# Altium project mantarray_beta2_sensor.PrjPcb (part 1 of 2)
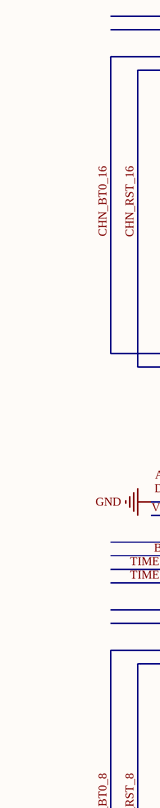
[diagram p0: mantarray_beta2_sensor.SchDoc, top left]
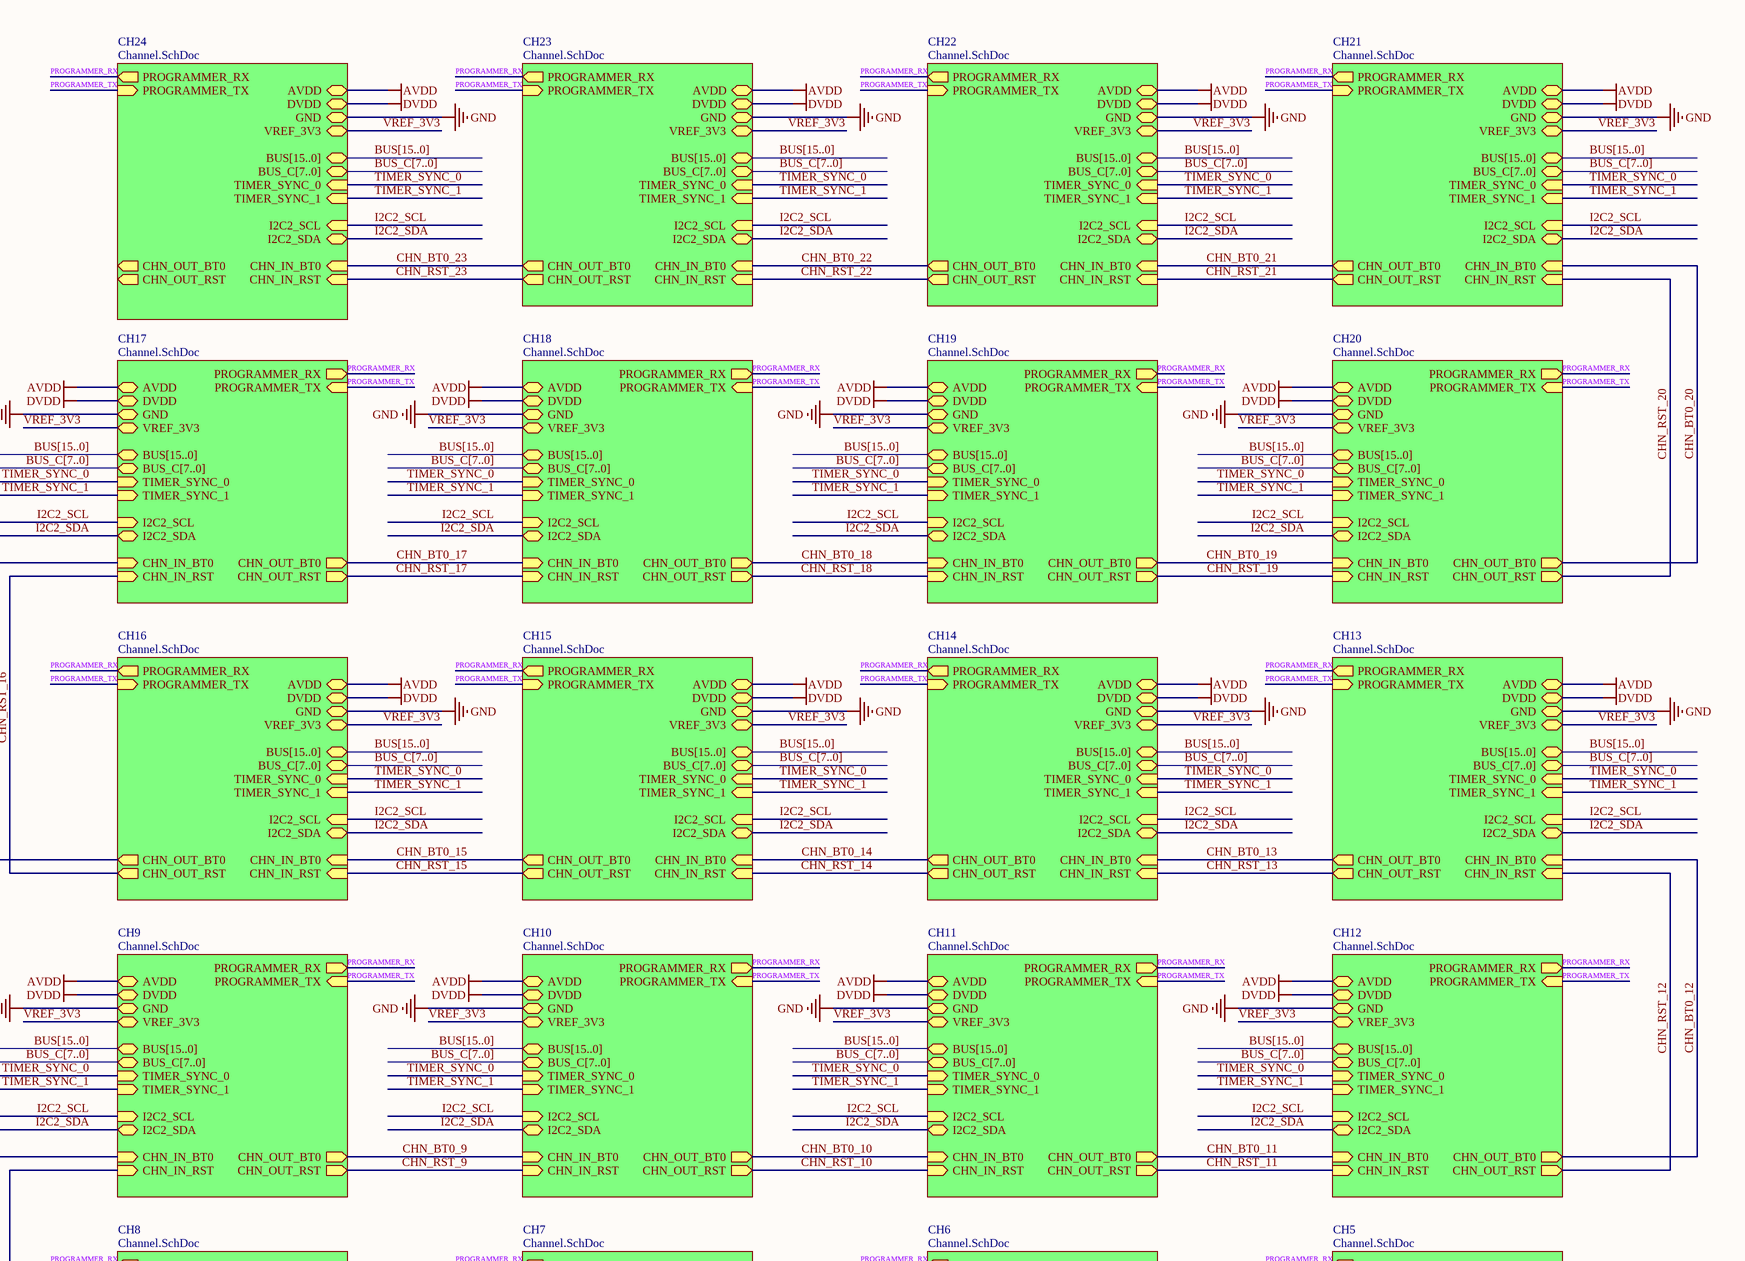
[diagram p1: mantarray_beta2_sensor.SchDoc, top right]
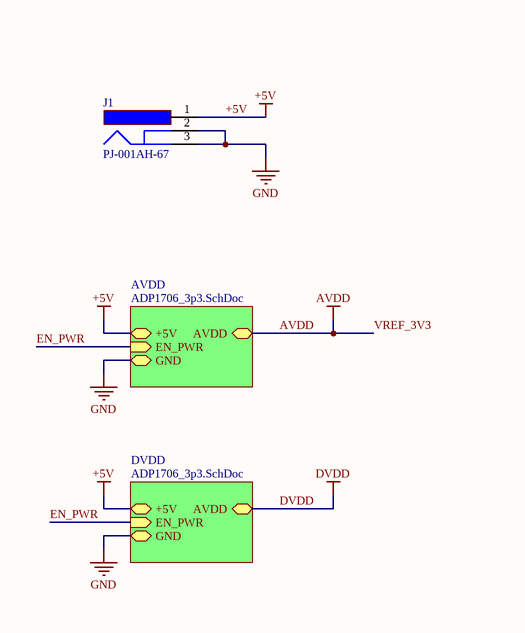
[diagram p2: mantarray_beta2_sensor.SchDoc, bottom left]
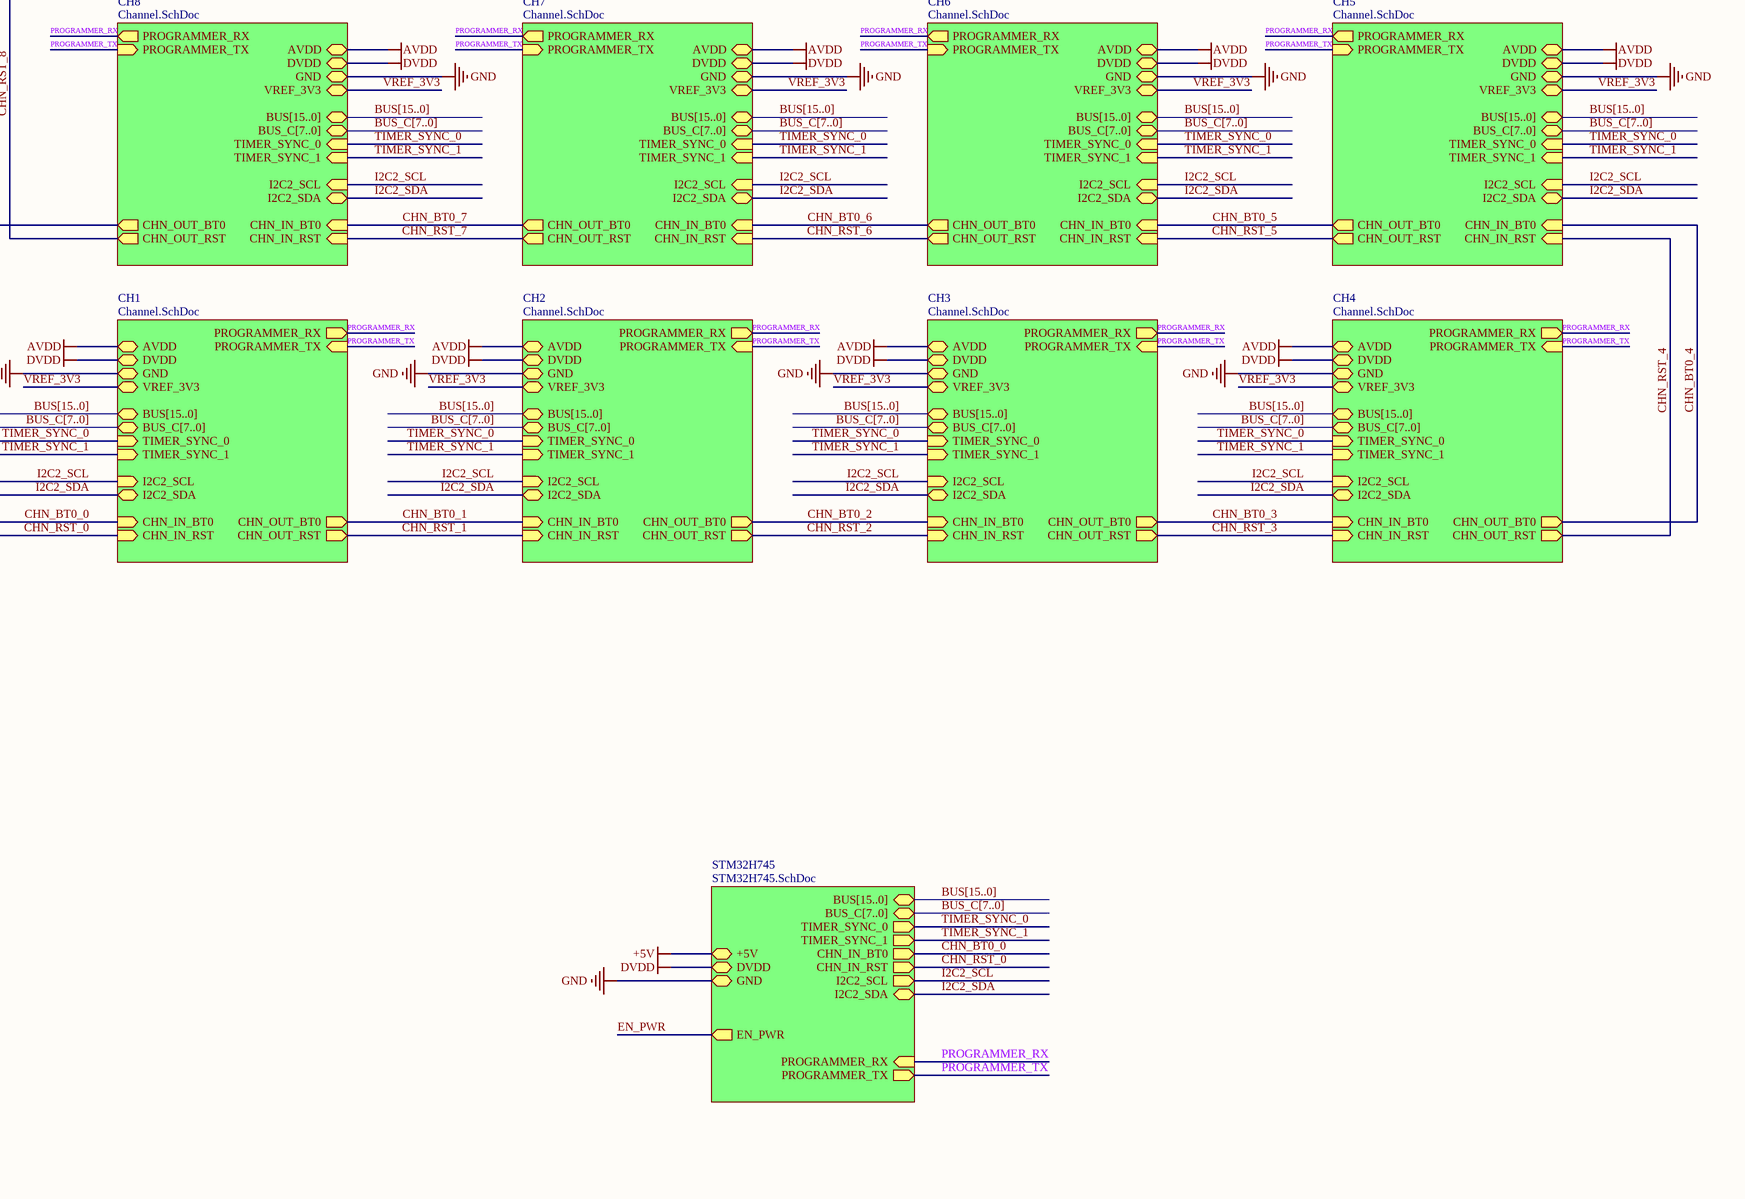
[diagram p3: mantarray_beta2_sensor.SchDoc, bottom right]
4 sheets, 470 parts. Net scope: hierarchical (ports join the sheet entries above them; power ports are global).
Board files: mantarray_beta2_sensor.PcbDoc, mantarray_beta2_sensor_arrayed.PcbDoc
Sheets:
  mantarray_beta2_sensor.SchDoc
    AVDD = ADP1706_3p3.SchDoc
    DVDD = ADP1706_3p3.SchDoc
    STM32H745 = STM32H745.SchDoc
    CH1 = Channel.SchDoc
    CH2 = Channel.SchDoc
    CH3 = Channel.SchDoc
    CH4 = Channel.SchDoc
    CH5 = Channel.SchDoc
    CH6 = Channel.SchDoc
    CH7 = Channel.SchDoc
    CH8 = Channel.SchDoc
    CH9 = Channel.SchDoc
    CH10 = Channel.SchDoc
    CH11 = Channel.SchDoc
    CH12 = Channel.SchDoc
    CH13 = Channel.SchDoc
    CH14 = Channel.SchDoc
    CH15 = Channel.SchDoc
    CH16 = Channel.SchDoc
    CH17 = Channel.SchDoc
    CH18 = Channel.SchDoc
    CH19 = Channel.SchDoc
    CH20 = Channel.SchDoc
    CH21 = Channel.SchDoc
    CH22 = Channel.SchDoc
    CH23 = Channel.SchDoc
    CH24 = Channel.SchDoc

## Sheet mantarray_beta2_sensor.SchDoc
size A1

### Parts
J1  PJ-001AH-67  [PJ-001AH-67]

### Sub-sheets
AVDD = ADP1706_3p3.SchDoc: GND (bidir), AVDD (bidir), +5V (bidir), EN_PWR (in)
CH1 = Channel.SchDoc: AVDD (bidir), DVDD (bidir), GND (bidir), BUS[15..0] (bidir), CHN_OUT_BT0 (out), CHN_OUT_RST (out), BUS_C[7..0] (bidir), VREF_3V3 (bidir), CHN_IN_RST (in), TIMER_SYNC_0 (in), CHN_IN_BT0 (in), TIMER_SYNC_1 (in), I2C2_SCL (in), I2C2_SDA (bidir), PROGRAMMER_RX (out), PROGRAMMER_TX (in)
CH2 = Channel.SchDoc: AVDD (bidir), DVDD (bidir), GND (bidir), BUS[15..0] (bidir), CHN_OUT_BT0 (out), CHN_OUT_RST (out), BUS_C[7..0] (bidir), VREF_3V3 (bidir), CHN_IN_RST (in), TIMER_SYNC_0 (in), CHN_IN_BT0 (in), TIMER_SYNC_1 (in), I2C2_SCL (in), I2C2_SDA (bidir), PROGRAMMER_RX (out), PROGRAMMER_TX (in)
CH3 = Channel.SchDoc: AVDD (bidir), DVDD (bidir), GND (bidir), BUS[15..0] (bidir), CHN_OUT_BT0 (out), CHN_OUT_RST (out), BUS_C[7..0] (bidir), VREF_3V3 (bidir), CHN_IN_RST (in), TIMER_SYNC_0 (in), CHN_IN_BT0 (in), TIMER_SYNC_1 (in), I2C2_SCL (in), I2C2_SDA (bidir), PROGRAMMER_RX (out), PROGRAMMER_TX (in)
CH4 = Channel.SchDoc: AVDD (bidir), DVDD (bidir), GND (bidir), BUS[15..0] (bidir), CHN_OUT_BT0 (out), CHN_OUT_RST (out), BUS_C[7..0] (bidir), VREF_3V3 (bidir), CHN_IN_RST (in), TIMER_SYNC_0 (in), CHN_IN_BT0 (in), TIMER_SYNC_1 (in), I2C2_SCL (in), I2C2_SDA (bidir), PROGRAMMER_RX (out), PROGRAMMER_TX (in)
CH5 = Channel.SchDoc: AVDD (bidir), DVDD (bidir), GND (bidir), BUS[15..0] (bidir), CHN_OUT_BT0 (out), CHN_OUT_RST (out), BUS_C[7..0] (bidir), VREF_3V3 (bidir), CHN_IN_RST (in), TIMER_SYNC_0 (in), CHN_IN_BT0 (in), TIMER_SYNC_1 (in), I2C2_SCL (in), I2C2_SDA (bidir), PROGRAMMER_TX (in), PROGRAMMER_RX (out)
CH6 = Channel.SchDoc: AVDD (bidir), DVDD (bidir), GND (bidir), BUS[15..0] (bidir), CHN_OUT_BT0 (out), CHN_OUT_RST (out), BUS_C[7..0] (bidir), VREF_3V3 (bidir), CHN_IN_RST (in), TIMER_SYNC_0 (in), CHN_IN_BT0 (in), TIMER_SYNC_1 (in), I2C2_SCL (in), I2C2_SDA (bidir), PROGRAMMER_RX (out), PROGRAMMER_TX (in)
CH7 = Channel.SchDoc: AVDD (bidir), DVDD (bidir), GND (bidir), BUS[15..0] (bidir), CHN_OUT_BT0 (out), CHN_OUT_RST (out), BUS_C[7..0] (bidir), VREF_3V3 (bidir), CHN_IN_RST (in), TIMER_SYNC_0 (in), CHN_IN_BT0 (in), TIMER_SYNC_1 (in), I2C2_SCL (in), I2C2_SDA (bidir), PROGRAMMER_RX (out), PROGRAMMER_TX (in)
CH8 = Channel.SchDoc: AVDD (bidir), DVDD (bidir), GND (bidir), BUS[15..0] (bidir), CHN_OUT_BT0 (out), CHN_OUT_RST (out), BUS_C[7..0] (bidir), VREF_3V3 (bidir), CHN_IN_RST (in), TIMER_SYNC_0 (in), CHN_IN_BT0 (in), TIMER_SYNC_1 (in), I2C2_SCL (in), I2C2_SDA (bidir), PROGRAMMER_RX (out), PROGRAMMER_TX (in)
CH9 = Channel.SchDoc: AVDD (bidir), DVDD (bidir), GND (bidir), BUS[15..0] (bidir), CHN_OUT_BT0 (out), CHN_OUT_RST (out), BUS_C[7..0] (bidir), VREF_3V3 (bidir), CHN_IN_RST (in), TIMER_SYNC_0 (in), CHN_IN_BT0 (in), TIMER_SYNC_1 (in), I2C2_SCL (in), I2C2_SDA (bidir), PROGRAMMER_RX (out), PROGRAMMER_TX (in)
CH10 = Channel.SchDoc: AVDD (bidir), DVDD (bidir), GND (bidir), BUS[15..0] (bidir), CHN_OUT_BT0 (out), CHN_OUT_RST (out), BUS_C[7..0] (bidir), VREF_3V3 (bidir), CHN_IN_RST (in), TIMER_SYNC_0 (in), CHN_IN_BT0 (in), TIMER_SYNC_1 (in), I2C2_SCL (in), I2C2_SDA (bidir), PROGRAMMER_TX (in), PROGRAMMER_RX (out)
CH11 = Channel.SchDoc: AVDD (bidir), DVDD (bidir), GND (bidir), BUS[15..0] (bidir), CHN_OUT_BT0 (out), CHN_OUT_RST (out), BUS_C[7..0] (bidir), VREF_3V3 (bidir), CHN_IN_RST (in), TIMER_SYNC_0 (in), CHN_IN_BT0 (in), TIMER_SYNC_1 (in), I2C2_SCL (in), I2C2_SDA (bidir), PROGRAMMER_RX (out), PROGRAMMER_TX (in)
CH12 = Channel.SchDoc: AVDD (bidir), DVDD (bidir), GND (bidir), BUS[15..0] (bidir), CHN_OUT_BT0 (out), CHN_OUT_RST (out), BUS_C[7..0] (bidir), VREF_3V3 (bidir), CHN_IN_RST (in), TIMER_SYNC_0 (in), CHN_IN_BT0 (in), TIMER_SYNC_1 (in), I2C2_SCL (in), I2C2_SDA (bidir), PROGRAMMER_TX (in), PROGRAMMER_RX (out)
CH13 = Channel.SchDoc: AVDD (bidir), DVDD (bidir), GND (bidir), BUS[15..0] (bidir), CHN_OUT_BT0 (out), CHN_OUT_RST (out), BUS_C[7..0] (bidir), VREF_3V3 (bidir), CHN_IN_RST (in), TIMER_SYNC_0 (in), CHN_IN_BT0 (in), TIMER_SYNC_1 (in), I2C2_SCL (in), I2C2_SDA (bidir), PROGRAMMER_RX (out), PROGRAMMER_TX (in)
CH14 = Channel.SchDoc: AVDD (bidir), DVDD (bidir), GND (bidir), BUS[15..0] (bidir), CHN_OUT_BT0 (out), CHN_OUT_RST (out), BUS_C[7..0] (bidir), VREF_3V3 (bidir), CHN_IN_RST (in), TIMER_SYNC_0 (in), CHN_IN_BT0 (in), TIMER_SYNC_1 (in), I2C2_SCL (in), I2C2_SDA (bidir), PROGRAMMER_RX (out), PROGRAMMER_TX (in)
CH15 = Channel.SchDoc: AVDD (bidir), DVDD (bidir), GND (bidir), BUS[15..0] (bidir), CHN_OUT_BT0 (out), CHN_OUT_RST (out), BUS_C[7..0] (bidir), VREF_3V3 (bidir), CHN_IN_RST (in), TIMER_SYNC_0 (in), CHN_IN_BT0 (in), TIMER_SYNC_1 (in), I2C2_SCL (in), I2C2_SDA (bidir), PROGRAMMER_RX (out), PROGRAMMER_TX (in)
CH16 = Channel.SchDoc: AVDD (bidir), DVDD (bidir), GND (bidir), BUS[15..0] (bidir), CHN_OUT_BT0 (out), CHN_OUT_RST (out), BUS_C[7..0] (bidir), VREF_3V3 (bidir), CHN_IN_RST (in), TIMER_SYNC_0 (in), CHN_IN_BT0 (in), TIMER_SYNC_1 (in), I2C2_SCL (in), I2C2_SDA (bidir), PROGRAMMER_TX (in), PROGRAMMER_RX (out)
CH17 = Channel.SchDoc: AVDD (bidir), DVDD (bidir), GND (bidir), BUS[15..0] (bidir), CHN_OUT_BT0 (out), CHN_OUT_RST (out), BUS_C[7..0] (bidir), VREF_3V3 (bidir), CHN_IN_RST (in), TIMER_SYNC_0 (in), CHN_IN_BT0 (in), TIMER_SYNC_1 (in), I2C2_SCL (in), I2C2_SDA (bidir), PROGRAMMER_TX (in), PROGRAMMER_RX (out)
CH18 = Channel.SchDoc: AVDD (bidir), DVDD (bidir), GND (bidir), BUS[15..0] (bidir), CHN_OUT_BT0 (out), CHN_OUT_RST (out), BUS_C[7..0] (bidir), VREF_3V3 (bidir), CHN_IN_RST (in), TIMER_SYNC_0 (in), CHN_IN_BT0 (in), TIMER_SYNC_1 (in), I2C2_SCL (in), I2C2_SDA (bidir), PROGRAMMER_RX (out), PROGRAMMER_TX (in)
CH19 = Channel.SchDoc: AVDD (bidir), DVDD (bidir), GND (bidir), BUS[15..0] (bidir), CHN_OUT_BT0 (out), CHN_OUT_RST (out), BUS_C[7..0] (bidir), VREF_3V3 (bidir), CHN_IN_RST (in), TIMER_SYNC_0 (in), CHN_IN_BT0 (in), TIMER_SYNC_1 (in), I2C2_SCL (in), I2C2_SDA (bidir), PROGRAMMER_TX (in), PROGRAMMER_RX (out)
CH20 = Channel.SchDoc: AVDD (bidir), DVDD (bidir), GND (bidir), BUS[15..0] (bidir), CHN_OUT_BT0 (out), CHN_OUT_RST (out), BUS_C[7..0] (bidir), VREF_3V3 (bidir), CHN_IN_RST (in), TIMER_SYNC_0 (in), CHN_IN_BT0 (in), TIMER_SYNC_1 (in), I2C2_SCL (in), I2C2_SDA (bidir), PROGRAMMER_RX (out), PROGRAMMER_TX (in)
CH21 = Channel.SchDoc: AVDD (bidir), DVDD (bidir), GND (bidir), BUS[15..0] (bidir), CHN_OUT_BT0 (out), CHN_OUT_RST (out), BUS_C[7..0] (bidir), VREF_3V3 (bidir), CHN_IN_RST (in), TIMER_SYNC_0 (in), CHN_IN_BT0 (in), TIMER_SYNC_1 (in), I2C2_SCL (in), I2C2_SDA (bidir), PROGRAMMER_TX (in), PROGRAMMER_RX (out)
CH22 = Channel.SchDoc: AVDD (bidir), DVDD (bidir), GND (bidir), BUS[15..0] (bidir), CHN_OUT_BT0 (out), CHN_OUT_RST (out), BUS_C[7..0] (bidir), VREF_3V3 (bidir), CHN_IN_RST (in), TIMER_SYNC_0 (in), CHN_IN_BT0 (in), TIMER_SYNC_1 (in), I2C2_SCL (in), I2C2_SDA (bidir), PROGRAMMER_TX (in), PROGRAMMER_RX (out)
CH23 = Channel.SchDoc: AVDD (bidir), DVDD (bidir), GND (bidir), BUS[15..0] (bidir), CHN_OUT_BT0 (out), CHN_OUT_RST (out), BUS_C[7..0] (bidir), VREF_3V3 (bidir), CHN_IN_RST (in), TIMER_SYNC_0 (in), CHN_IN_BT0 (in), TIMER_SYNC_1 (in), I2C2_SCL (in), I2C2_SDA (bidir), PROGRAMMER_RX (out), PROGRAMMER_TX (in)
CH24 = Channel.SchDoc: AVDD (bidir), DVDD (bidir), GND (bidir), BUS[15..0] (bidir), CHN_OUT_BT0 (out), CHN_OUT_RST (out), BUS_C[7..0] (bidir), VREF_3V3 (bidir), CHN_IN_RST (in), TIMER_SYNC_0 (in), CHN_IN_BT0 (in), TIMER_SYNC_1 (in), I2C2_SCL (in), I2C2_SDA (bidir), PROGRAMMER_RX (out), PROGRAMMER_TX (in)
DVDD = ADP1706_3p3.SchDoc: GND (bidir), AVDD (bidir), +5V (bidir), EN_PWR (in)
STM32H745 = STM32H745.SchDoc: GND (bidir), DVDD (bidir), +5V (bidir), BUS[15..0] (bidir), BUS_C[7..0] (bidir), TIMER_SYNC_0 (out), I2C2_SDA (bidir), I2C2_SCL (out), TIMER_SYNC_1 (out), CHN_IN_BT0 (out), CHN_IN_RST (out), PROGRAMMER_RX (in), PROGRAMMER_TX (out), EN_PWR (out)

### Nets
+5V: J1.1 ; sheet AVDD/+5V, sheet DVDD/+5V, sheet STM32H745/+5V
AVDD: sheet AVDD/AVDD, sheet CH1/AVDD, sheet CH1/VREF_3V3, sheet CH2/AVDD, sheet CH2/VREF_3V3, sheet CH3/AVDD, sheet CH3/VREF_3V3, sheet CH4/AVDD, sheet CH4/VREF_3V3, sheet CH5/AVDD, sheet CH5/VREF_3V3, sheet CH6/AVDD, sheet CH6/VREF_3V3, sheet CH7/AVDD, sheet CH7/VREF_3V3, sheet CH8/AVDD, sheet CH8/VREF_3V3, sheet CH9/AVDD, sheet CH9/VREF_3V3, sheet CH10/AVDD, sheet CH10/VREF_3V3, sheet CH11/AVDD, sheet CH11/VREF_3V3, sheet CH12/AVDD, sheet CH12/VREF_3V3, sheet CH13/AVDD, sheet CH13/VREF_3V3, sheet CH14/AVDD, sheet CH14/VREF_3V3, sheet CH15/AVDD, sheet CH15/VREF_3V3, sheet CH16/AVDD, sheet CH16/VREF_3V3, sheet CH17/AVDD, sheet CH17/VREF_3V3, sheet CH18/AVDD, sheet CH18/VREF_3V3, sheet CH19/AVDD, sheet CH19/VREF_3V3, sheet CH20/AVDD, sheet CH20/VREF_3V3, sheet CH21/AVDD, sheet CH21/VREF_3V3, sheet CH22/AVDD, sheet CH22/VREF_3V3, sheet CH23/AVDD, sheet CH23/VREF_3V3, sheet CH24/AVDD, sheet CH24/VREF_3V3  [also labelled VREF_3V3]
DVDD: sheet DVDD/AVDD, sheet STM32H745/DVDD, sheet CH1/DVDD, sheet CH2/DVDD, sheet CH3/DVDD, sheet CH4/DVDD, sheet CH5/DVDD, sheet CH6/DVDD, sheet CH7/DVDD, sheet CH8/DVDD, sheet CH9/DVDD, sheet CH10/DVDD, sheet CH11/DVDD, sheet CH12/DVDD, sheet CH13/DVDD, sheet CH14/DVDD, sheet CH15/DVDD, sheet CH16/DVDD, sheet CH17/DVDD, sheet CH18/DVDD, sheet CH19/DVDD, sheet CH20/DVDD, sheet CH21/DVDD, sheet CH22/DVDD, sheet CH23/DVDD, sheet CH24/DVDD  [project net AVDD]
GND: J1.2 J1.3 ; sheet AVDD/GND, sheet DVDD/GND, sheet STM32H745/GND, sheet CH1/GND, sheet CH2/GND, sheet CH3/GND, sheet CH4/GND, sheet CH5/GND, sheet CH6/GND, sheet CH7/GND, sheet CH8/GND, sheet CH9/GND, sheet CH10/GND, sheet CH11/GND, sheet CH12/GND, sheet CH13/GND, sheet CH14/GND, sheet CH15/GND, sheet CH16/GND, sheet CH17/GND, sheet CH18/GND, sheet CH19/GND, sheet CH20/GND, sheet CH21/GND, sheet CH22/GND, sheet CH23/GND, sheet CH24/GND
CHN_BT0_0: sheet STM32H745/CHN_IN_BT0, sheet CH1/CHN_IN_BT0
CHN_BT0_1: sheet CH1/CHN_OUT_BT0, sheet CH2/CHN_IN_BT0
CHN_BT0_2: sheet CH2/CHN_OUT_BT0, sheet CH3/CHN_IN_BT0
CHN_BT0_3: sheet CH3/CHN_OUT_BT0, sheet CH4/CHN_IN_BT0
CHN_BT0_4: sheet CH4/CHN_OUT_BT0, sheet CH5/CHN_IN_BT0
CHN_BT0_5: sheet CH5/CHN_OUT_BT0, sheet CH6/CHN_IN_BT0
CHN_BT0_6: sheet CH6/CHN_OUT_BT0, sheet CH7/CHN_IN_BT0
CHN_BT0_7: sheet CH7/CHN_OUT_BT0, sheet CH8/CHN_IN_BT0
CHN_BT0_8: sheet CH8/CHN_OUT_BT0, sheet CH9/CHN_IN_BT0
CHN_BT0_9: sheet CH9/CHN_OUT_BT0, sheet CH10/CHN_IN_BT0
CHN_BT0_10: sheet CH10/CHN_OUT_BT0, sheet CH11/CHN_IN_BT0
CHN_BT0_11: sheet CH11/CHN_OUT_BT0, sheet CH12/CHN_IN_BT0
CHN_BT0_12: sheet CH12/CHN_OUT_BT0, sheet CH13/CHN_IN_BT0
CHN_BT0_13: sheet CH13/CHN_OUT_BT0, sheet CH14/CHN_IN_BT0
CHN_BT0_14: sheet CH14/CHN_OUT_BT0, sheet CH15/CHN_IN_BT0
CHN_BT0_15: sheet CH15/CHN_OUT_BT0, sheet CH16/CHN_IN_BT0
CHN_BT0_16: sheet CH16/CHN_OUT_BT0, sheet CH17/CHN_IN_BT0
CHN_BT0_17: sheet CH17/CHN_OUT_BT0, sheet CH18/CHN_IN_BT0
CHN_BT0_18: sheet CH18/CHN_OUT_BT0, sheet CH19/CHN_IN_BT0
CHN_BT0_19: sheet CH19/CHN_OUT_BT0, sheet CH20/CHN_IN_BT0
CHN_BT0_20: sheet CH20/CHN_OUT_BT0, sheet CH21/CHN_IN_BT0
CHN_BT0_21: sheet CH21/CHN_OUT_BT0, sheet CH22/CHN_IN_BT0
CHN_BT0_22: sheet CH22/CHN_OUT_BT0, sheet CH23/CHN_IN_BT0
CHN_BT0_23: sheet CH23/CHN_OUT_BT0, sheet CH24/CHN_IN_BT0
CHN_RST_0: sheet STM32H745/CHN_IN_RST, sheet CH1/CHN_IN_RST  [project net CHN_IN_RST]
CHN_RST_1: sheet CH1/CHN_OUT_RST, sheet CH2/CHN_IN_RST  [project net CHN_IN_RST]
CHN_RST_2: sheet CH2/CHN_OUT_RST, sheet CH3/CHN_IN_RST  [project net CHN_IN_RST]
CHN_RST_3: sheet CH3/CHN_OUT_RST, sheet CH4/CHN_IN_RST  [project net CHN_IN_RST]
CHN_RST_4: sheet CH4/CHN_OUT_RST, sheet CH5/CHN_IN_RST  [project net CHN_IN_RST]
CHN_RST_5: sheet CH5/CHN_OUT_RST, sheet CH6/CHN_IN_RST  [project net CHN_IN_RST]
CHN_RST_6: sheet CH6/CHN_OUT_RST, sheet CH7/CHN_IN_RST  [project net CHN_IN_RST]
CHN_RST_7: sheet CH7/CHN_OUT_RST, sheet CH8/CHN_IN_RST  [project net CHN_IN_RST]
CHN_RST_8: sheet CH8/CHN_OUT_RST, sheet CH9/CHN_IN_RST  [project net CHN_IN_RST]
CHN_RST_9: sheet CH9/CHN_OUT_RST, sheet CH10/CHN_IN_RST  [project net CHN_IN_RST]
CHN_RST_10: sheet CH10/CHN_OUT_RST, sheet CH11/CHN_IN_RST  [project net CHN_IN_RST]
CHN_RST_11: sheet CH11/CHN_OUT_RST, sheet CH12/CHN_IN_RST  [project net CHN_IN_RST]
CHN_RST_12: sheet CH12/CHN_OUT_RST, sheet CH13/CHN_IN_RST  [project net CHN_IN_RST]
CHN_RST_13: sheet CH13/CHN_OUT_RST, sheet CH14/CHN_IN_RST  [project net CHN_IN_RST]
CHN_RST_14: sheet CH14/CHN_OUT_RST, sheet CH15/CHN_IN_RST  [project net CHN_IN_RST]
CHN_RST_15: sheet CH15/CHN_OUT_RST, sheet CH16/CHN_IN_RST  [project net CHN_IN_RST]
CHN_RST_16: sheet CH16/CHN_OUT_RST, sheet CH17/CHN_IN_RST  [project net CHN_IN_RST]
CHN_RST_17: sheet CH17/CHN_OUT_RST, sheet CH18/CHN_IN_RST  [project net CHN_IN_RST]
CHN_RST_18: sheet CH18/CHN_OUT_RST, sheet CH19/CHN_IN_RST  [project net CHN_IN_RST]
CHN_RST_19: sheet CH19/CHN_OUT_RST, sheet CH20/CHN_IN_RST  [project net CHN_IN_RST]
CHN_RST_20: sheet CH20/CHN_OUT_RST, sheet CH21/CHN_IN_RST  [project net CHN_IN_RST]
CHN_RST_21: sheet CH21/CHN_OUT_RST, sheet CH22/CHN_IN_RST  [project net CHN_IN_RST]
CHN_RST_22: sheet CH22/CHN_OUT_RST, sheet CH23/CHN_IN_RST  [project net CHN_IN_RST]
CHN_RST_23: sheet CH23/CHN_OUT_RST, sheet CH24/CHN_IN_RST  [project net CHN_IN_RST]
EN_PWR: sheet AVDD/EN_PWR, sheet DVDD/EN_PWR, sheet STM32H745/EN_PWR
I2C2_SCL: sheet STM32H745/I2C2_SCL, sheet CH1/I2C2_SCL, sheet CH2/I2C2_SCL, sheet CH3/I2C2_SCL, sheet CH4/I2C2_SCL, sheet CH5/I2C2_SCL, sheet CH6/I2C2_SCL, sheet CH7/I2C2_SCL, sheet CH8/I2C2_SCL, sheet CH9/I2C2_SCL, sheet CH10/I2C2_SCL, sheet CH11/I2C2_SCL, sheet CH12/I2C2_SCL, sheet CH13/I2C2_SCL, sheet CH14/I2C2_SCL, sheet CH15/I2C2_SCL, sheet CH16/I2C2_SCL, sheet CH17/I2C2_SCL, sheet CH18/I2C2_SCL, sheet CH19/I2C2_SCL, sheet CH20/I2C2_SCL, sheet CH21/I2C2_SCL, sheet CH22/I2C2_SCL, sheet CH23/I2C2_SCL, sheet CH24/I2C2_SCL
I2C2_SDA: sheet STM32H745/I2C2_SDA, sheet CH1/I2C2_SDA, sheet CH2/I2C2_SDA, sheet CH3/I2C2_SDA, sheet CH4/I2C2_SDA, sheet CH5/I2C2_SDA, sheet CH6/I2C2_SDA, sheet CH7/I2C2_SDA, sheet CH8/I2C2_SDA, sheet CH9/I2C2_SDA, sheet CH10/I2C2_SDA, sheet CH11/I2C2_SDA, sheet CH12/I2C2_SDA, sheet CH13/I2C2_SDA, sheet CH14/I2C2_SDA, sheet CH15/I2C2_SDA, sheet CH16/I2C2_SDA, sheet CH17/I2C2_SDA, sheet CH18/I2C2_SDA, sheet CH19/I2C2_SDA, sheet CH20/I2C2_SDA, sheet CH21/I2C2_SDA, sheet CH22/I2C2_SDA, sheet CH23/I2C2_SDA, sheet CH24/I2C2_SDA
PROGRAMMER_RX: sheet STM32H745/PROGRAMMER_RX, sheet CH1/PROGRAMMER_RX, sheet CH2/PROGRAMMER_RX, sheet CH3/PROGRAMMER_RX, sheet CH4/PROGRAMMER_RX, sheet CH5/PROGRAMMER_RX, sheet CH6/PROGRAMMER_RX, sheet CH7/PROGRAMMER_RX, sheet CH8/PROGRAMMER_RX, sheet CH9/PROGRAMMER_RX, sheet CH10/PROGRAMMER_RX, sheet CH11/PROGRAMMER_RX, sheet CH12/PROGRAMMER_RX, sheet CH13/PROGRAMMER_RX, sheet CH14/PROGRAMMER_RX, sheet CH15/PROGRAMMER_RX, sheet CH16/PROGRAMMER_RX, sheet CH17/PROGRAMMER_RX, sheet CH18/PROGRAMMER_RX, sheet CH19/PROGRAMMER_RX, sheet CH20/PROGRAMMER_RX, sheet CH21/PROGRAMMER_RX, sheet CH22/PROGRAMMER_RX, sheet CH23/PROGRAMMER_RX, sheet CH24/PROGRAMMER_RX
PROGRAMMER_TX: sheet STM32H745/PROGRAMMER_TX, sheet CH1/PROGRAMMER_TX, sheet CH2/PROGRAMMER_TX, sheet CH3/PROGRAMMER_TX, sheet CH4/PROGRAMMER_TX, sheet CH5/PROGRAMMER_TX, sheet CH6/PROGRAMMER_TX, sheet CH7/PROGRAMMER_TX, sheet CH8/PROGRAMMER_TX, sheet CH9/PROGRAMMER_TX, sheet CH10/PROGRAMMER_TX, sheet CH11/PROGRAMMER_TX, sheet CH12/PROGRAMMER_TX, sheet CH13/PROGRAMMER_TX, sheet CH14/PROGRAMMER_TX, sheet CH15/PROGRAMMER_TX, sheet CH16/PROGRAMMER_TX, sheet CH17/PROGRAMMER_TX, sheet CH18/PROGRAMMER_TX, sheet CH19/PROGRAMMER_TX, sheet CH20/PROGRAMMER_TX, sheet CH21/PROGRAMMER_TX, sheet CH22/PROGRAMMER_TX, sheet CH23/PROGRAMMER_TX, sheet CH24/PROGRAMMER_TX
TIMER_SYNC_0: sheet STM32H745/TIMER_SYNC_0, sheet CH1/TIMER_SYNC_0, sheet CH2/TIMER_SYNC_0, sheet CH3/TIMER_SYNC_0, sheet CH4/TIMER_SYNC_0, sheet CH5/TIMER_SYNC_0, sheet CH6/TIMER_SYNC_0, sheet CH7/TIMER_SYNC_0, sheet CH8/TIMER_SYNC_0, sheet CH9/TIMER_SYNC_0, sheet CH10/TIMER_SYNC_0, sheet CH11/TIMER_SYNC_0, sheet CH12/TIMER_SYNC_0, sheet CH13/TIMER_SYNC_0, sheet CH14/TIMER_SYNC_0, sheet CH15/TIMER_SYNC_0, sheet CH16/TIMER_SYNC_0, sheet CH17/TIMER_SYNC_0, sheet CH18/TIMER_SYNC_0, sheet CH19/TIMER_SYNC_0, sheet CH20/TIMER_SYNC_0, sheet CH21/TIMER_SYNC_0, sheet CH22/TIMER_SYNC_0, sheet CH23/TIMER_SYNC_0, sheet CH24/TIMER_SYNC_0
TIMER_SYNC_1: sheet STM32H745/TIMER_SYNC_1, sheet CH1/TIMER_SYNC_1, sheet CH2/TIMER_SYNC_1, sheet CH3/TIMER_SYNC_1, sheet CH4/TIMER_SYNC_1, sheet CH5/TIMER_SYNC_1, sheet CH6/TIMER_SYNC_1, sheet CH7/TIMER_SYNC_1, sheet CH8/TIMER_SYNC_1, sheet CH9/TIMER_SYNC_1, sheet CH10/TIMER_SYNC_1, sheet CH11/TIMER_SYNC_1, sheet CH12/TIMER_SYNC_1, sheet CH13/TIMER_SYNC_1, sheet CH14/TIMER_SYNC_1, sheet CH15/TIMER_SYNC_1, sheet CH16/TIMER_SYNC_1, sheet CH17/TIMER_SYNC_1, sheet CH18/TIMER_SYNC_1, sheet CH19/TIMER_SYNC_1, sheet CH20/TIMER_SYNC_1, sheet CH21/TIMER_SYNC_1, sheet CH22/TIMER_SYNC_1, sheet CH23/TIMER_SYNC_1, sheet CH24/TIMER_SYNC_1

### Buses and harness runs
bus BUS[15..0] = sheet CH1/BUS[15..0]
bus BUS[15..0] = sheet CH2/BUS[15..0]
bus BUS[15..0] = sheet CH3/BUS[15..0]
bus BUS[15..0] = sheet CH4/BUS[15..0]
bus BUS[15..0] = sheet CH5/BUS[15..0]
bus BUS[15..0] = sheet CH6/BUS[15..0]
bus BUS[15..0] = sheet CH7/BUS[15..0]
bus BUS[15..0] = sheet CH8/BUS[15..0]
bus BUS[15..0] = sheet CH9/BUS[15..0]
bus BUS[15..0] = sheet CH10/BUS[15..0]
bus BUS[15..0] = sheet CH11/BUS[15..0]
bus BUS[15..0] = sheet CH12/BUS[15..0]
bus BUS[15..0] = sheet CH13/BUS[15..0]
bus BUS[15..0] = sheet CH14/BUS[15..0]
bus BUS[15..0] = sheet CH15/BUS[15..0]
bus BUS[15..0] = sheet CH16/BUS[15..0]
bus BUS[15..0] = sheet CH17/BUS[15..0]
bus BUS[15..0] = sheet CH18/BUS[15..0]
bus BUS[15..0] = sheet CH19/BUS[15..0]
bus BUS[15..0] = sheet CH20/BUS[15..0]
bus BUS[15..0] = sheet CH21/BUS[15..0]
bus BUS[15..0] = sheet CH22/BUS[15..0]
bus BUS[15..0] = sheet CH23/BUS[15..0]
bus BUS[15..0] = sheet CH24/BUS[15..0]
bus BUS[15..0] = sheet STM32H745/BUS[15..0]
bus BUS_C[7..0] = sheet CH1/BUS_C[7..0]
bus BUS_C[7..0] = sheet CH2/BUS_C[7..0]
bus BUS_C[7..0] = sheet CH3/BUS_C[7..0]
bus BUS_C[7..0] = sheet CH4/BUS_C[7..0]
bus BUS_C[7..0] = sheet CH5/BUS_C[7..0]
bus BUS_C[7..0] = sheet CH6/BUS_C[7..0]
bus BUS_C[7..0] = sheet CH7/BUS_C[7..0]
bus BUS_C[7..0] = sheet CH8/BUS_C[7..0]
bus BUS_C[7..0] = sheet CH9/BUS_C[7..0]
bus BUS_C[7..0] = sheet CH10/BUS_C[7..0]
bus BUS_C[7..0] = sheet CH11/BUS_C[7..0]
bus BUS_C[7..0] = sheet CH12/BUS_C[7..0]
bus BUS_C[7..0] = sheet CH13/BUS_C[7..0]
bus BUS_C[7..0] = sheet CH14/BUS_C[7..0]
bus BUS_C[7..0] = sheet CH15/BUS_C[7..0]
bus BUS_C[7..0] = sheet CH16/BUS_C[7..0]
bus BUS_C[7..0] = sheet CH17/BUS_C[7..0]
bus BUS_C[7..0] = sheet CH18/BUS_C[7..0]
bus BUS_C[7..0] = sheet CH19/BUS_C[7..0]
bus BUS_C[7..0] = sheet CH20/BUS_C[7..0]
bus BUS_C[7..0] = sheet CH21/BUS_C[7..0]
bus BUS_C[7..0] = sheet CH22/BUS_C[7..0]
bus BUS_C[7..0] = sheet CH23/BUS_C[7..0]
bus BUS_C[7..0] = sheet CH24/BUS_C[7..0]
bus BUS_C[7..0] = sheet STM32H745/BUS_C[7..0]

### Notes on the sheet
- Title
- Size:
- Date:
- File:
- A1
- Number:
- Time:
- Revision:
- Sheet
- of

### Library data of the parts
J1 = PJ-001AH-67: IP67 waterproof DC Power Jack; Digikey: https://www.digikey.com/en/products/detail/cui-devices/PJ-001AH-67/9866231?s=N4IgTCBcDaIAoCkC0AGFBGAggCSQNgHYQBdAXyA

## Sheet ADP1706_3p3.SchDoc
size A; DocumentNumber: 6; SheetNumber: 6; SheetTotal: 12
Used 2 times, as channels AVDD, DVDD. Parts and nets are listed once, with the designators drawn on the sheet.
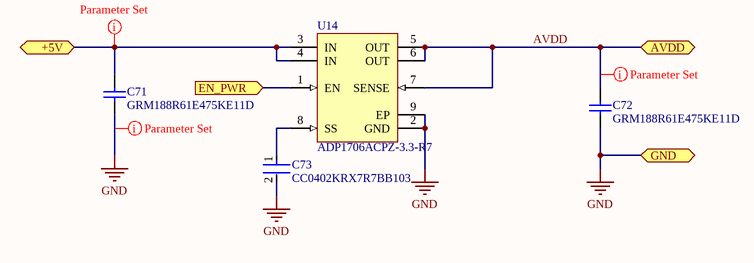
[diagram p4: ADP1706_3p3.SchDoc]

### Parts
C71  GRM188R61E475KE11D  [CAPC1608X90X35LL10T15]
C72  GRM188R61E475KE11D  [CAPC1608X90X35LL10T15]
C73  CC0402KRX7R7BB103  [FP-CC0402-MFG]
U14  ADP1706ACPZ-3.3-R7  [ADI-CP-8-2_L]

### Ports
+5V (bidir), AVDD (bidir), EN_PWR (in), GND (bidir)

### Nets
GND: C71.1 C72.1 C73.2 U14.2(GND) U14.9(EP) ; port GND
+5V: C71.2 U14.3(IN) U14.4(IN) ; port +5V
AVDD: C72.2 U14.5(OUT) U14.6(OUT) U14.7(SENSE) ; port AVDD
EN_PWR: U14.1(EN) ; port EN_PWR
NetC73_1: C73.1 U14.8(SS)

### Channels
AVDD: designators end in _AVDD; ports +5V=+5V AVDD=AVDD EN_PWR=EN_PWR GND=GND
DVDD: designators end in _DVDD; ports +5V=+5V AVDD=AVDD EN_PWR=EN_PWR GND=GND

### Layout directives
net class POWER: +5V, AVDD, GND

### Library data of the parts
C71 C72 = CMP-2006-02523-1: Manufacturer: Murata; Part Number: GRM188R61E475KE11D
C73 = CMP-03422-000501-1: CAP CER 10000PF 16V X7R 0402; Manufacturer: YAGEO; Automotive Grade: NA; Capacitance: 10 nF; Material: Ceramic; Value: 10 nF; Tolerance: 0.1; Temperature Coefficient: 30ppm/°C; Temperature Range Low: -55°C; Temperature Range High: +125°C; Mouser Description: 0402 10 nF 16 V ±10 % Tolerance X7R SMT Multilayer Ceramic Capacitor; Footprint Url: http://www.yageo.com/exep/pages/download/literatures/UPY-C_GEN_24.pdf; Category: Cap; RoHS: TRUE; Manufacturer Part Number: CC0402KRX7R7BB103; ComponentLink2Description: Datasheet; Ipc Land Pattern Name: CAPC10050X50; Automotive: No; ComponentLink2URL: http://www.yageo.com/documents/recent/UPY-GP_NP0_16V-to-50V_16.pdf; Device Class L1: Passive Components; Height: 0.55mm; Temperature Characteristic: X7R; Package: CC0402; Voltage Rating: 16 V; Device Class L3: Ceramic Capacitors; Lead Free: Yes; Device Class L2: Capacitors; Digikey Description: CAP CER 10000PF 16V X7R 0402; Octopart: https://octopart.com/cc0402krx7r7bb103-yageo-192895; Temperature: -55°C to +125°C
U14 = CMP-0786-00090-1: 1 A, Low Dropout, CMOS Linear Regulator, 2.5 to 5.5 V Vin, 3.3 V Vout, Industrial, 8-pin QFN (CP-8-2), Reel; Manufacturer: Analog Devices; Vin (max) (V): 5.5; Vin (min) (V): 2.5; Iout max: 1A; Supply Current IGND @ Small Load: 50uA; Preset Vout Values (V): 3.3; Mounting Technology: Surface Mount; PartNumber: ADP1706ACPZ-3.3-R7; ComponentLink3Description: Package Specification; PackageReference: CP-8-2; PackageDescription: 8-Pin Lead Frame Chip Scale Package, Body 3 x 3 mm, Pitch 0.5 mm; ComponentLink1Description: Manufacturer URL; ComponentLink1URL: http://www.analog.com/en/index.html; ComponentLink4Description: URL Link1; ComponentLink2Description: Datasheet; ComponentLink2URL: http://www.analog.com/static/imported-files/data_sheets/ADP1706_1707_1708.pdf; DatasheetVersion: Rev. 0; ComponentLink3URL: http://www.analog.com/static/imported-files/packages/56953322593982CP_8_2.pdf; PackageVersion: 061507-B, 06/2007; Packing: Reel; ComponentLink4URL: Product URL:http://www.analog.com/en/ADP1706/productSearch.html; digikey: https://www.digikey.com/en/products/detail/analog-devices-inc/ADP1706ACPZ-3-3-R7/1662724

## Sheet STM32H745.SchDoc
size A
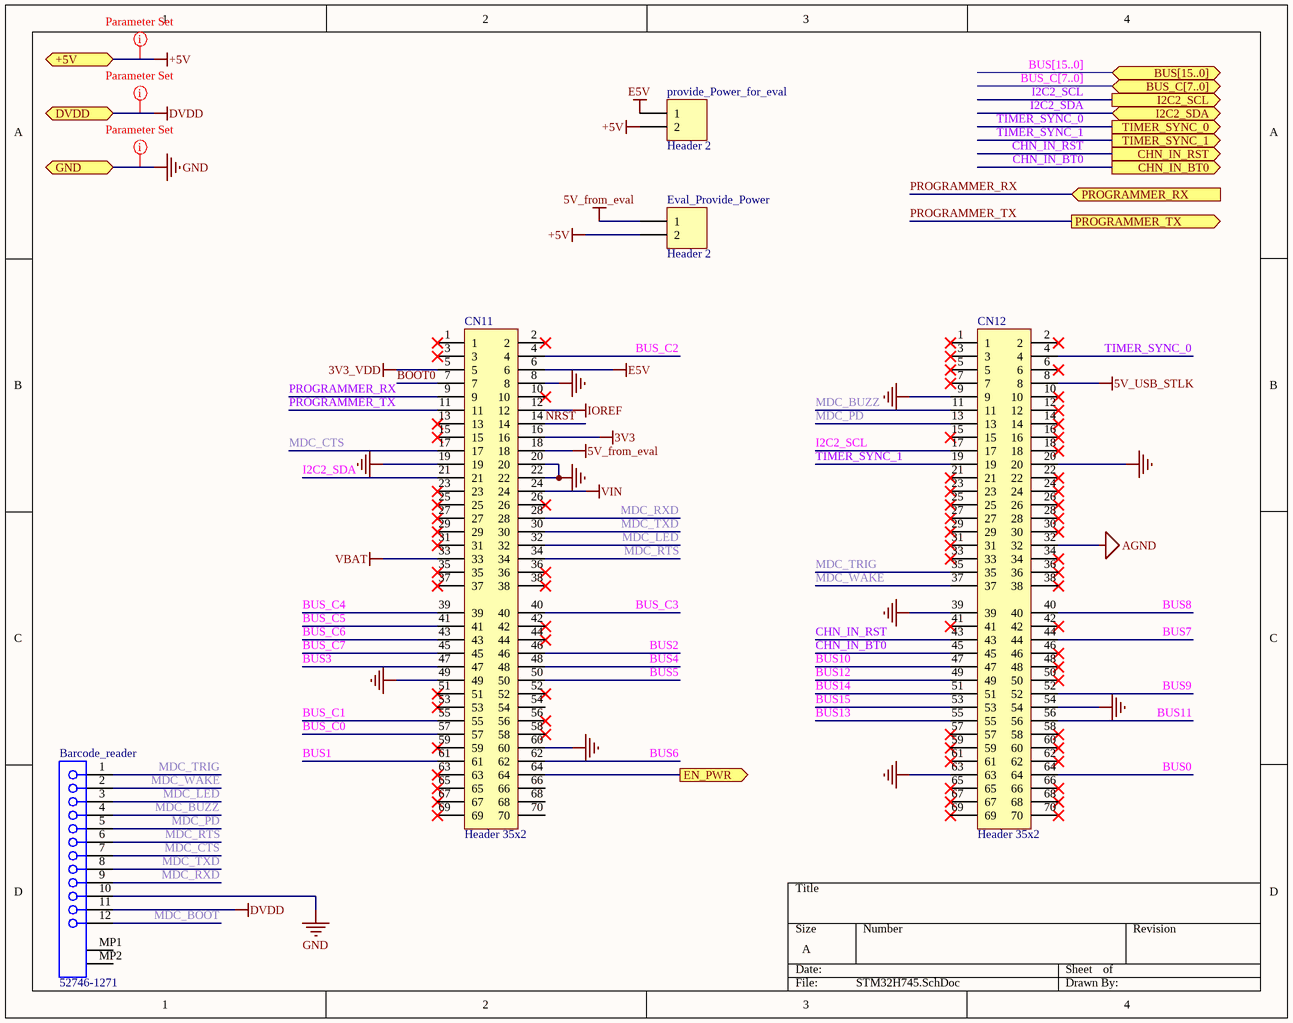
[diagram p5: STM32H745.SchDoc]

### Parts
Barcode_reader  52746-1271  [MOLX-52746-1271]
CN11  Header 35x2  [HDR_2x36_2R54_V_M]
CN12  Header 35x2  [HDR_2x36_2R54_V_M]
Eval_Provide_Power  Header 2  [HDR1X2]
provide_Power_for_eval  Header 2  [HDR1X2]

### Ports
+5V (bidir), BUS[15..0] (bidir), BUS_C[7..0] (bidir), CHN_IN_BT0 (out), CHN_IN_RST (out), DVDD (bidir), EN_PWR (out), GND (bidir), I2C2_SCL (out), I2C2_SDA (bidir), PROGRAMMER_RX (in), PROGRAMMER_TX (out), TIMER_SYNC_0 (out), TIMER_SYNC_1 (out)

### Nets
3V3: CN11.16
3V3_VDD: CN11.5
5V_from_eval: CN11.18 Eval_Provide_Power.1
5V_USB_STLK: CN12.8
+5V: Eval_Provide_Power.2 provide_Power_for_eval.2 ; port +5V
AGND: CN12.32
DVDD: Barcode_reader.11 ; port DVDD  [project net AVDD]
E5V: CN11.6 provide_Power_for_eval.1
GND: Barcode_reader.10 CN11.8 CN11.19 CN11.20 CN11.22 CN11.49 CN11.60 CN12.9 CN12.20 CN12.39 CN12.54 CN12.63 ; port GND
IOREF: CN11.12
VBAT: CN11.33
VIN: CN11.24
BOOT0: CN11.7
BUS0: CN12.64
BUS1: CN11.61
BUS2: CN11.46
BUS3: CN11.47
BUS4: CN11.48
BUS5: CN11.50
BUS6: CN11.62
BUS7: CN12.44
BUS8: CN12.40
BUS9: CN12.52
BUS10: CN12.47
BUS11: CN12.56
BUS12: CN12.49
BUS13: CN12.55
BUS14: CN12.51
BUS15: CN12.53
BUS_C0: CN11.57
BUS_C1: CN11.55
BUS_C2: CN11.4
BUS_C3: CN11.40
BUS_C4: CN11.39
BUS_C5: CN11.41
BUS_C6: CN11.43
BUS_C7: CN11.45
CHN_IN_BT0: CN12.45 ; port CHN_IN_BT0  [project net CHN_BT0_0]
CHN_IN_RST: CN12.43 ; port CHN_IN_RST
EN_PWR: CN11.64 ; port EN_PWR
I2C2_SCL: CN12.17 ; port I2C2_SCL
I2C2_SDA: CN11.21 ; port I2C2_SDA
MDC_BOOT: Barcode_reader.12
MDC_BUZZ: Barcode_reader.4 CN12.11
MDC_CTS: Barcode_reader.7 CN11.17
MDC_LED: Barcode_reader.3 CN11.32
MDC_PD: Barcode_reader.5 CN12.13
MDC_RTS: Barcode_reader.6 CN11.34
MDC_RXD: Barcode_reader.9 CN11.28
MDC_TRIG: Barcode_reader.1 CN12.35
MDC_TXD: Barcode_reader.8 CN11.30
MDC_WAKE: Barcode_reader.2 CN12.37
NRST: CN11.14
PROGRAMMER_RX: CN11.9 ; port PROGRAMMER_RX
PROGRAMMER_TX: CN11.11 ; port PROGRAMMER_TX
TIMER_SYNC_0: CN12.4 ; port TIMER_SYNC_0
TIMER_SYNC_1: CN12.19 ; port TIMER_SYNC_1

Not connected (* = marked no-connect by the designer): Barcode_reader MP1 MP2; CN11 1* 2* 3* 10* 13* 15* 23* 25* 26* 27* 29* 31* 35* 36* 37* 38* 42* 44* 51* 52* 53* 54 56* 58* 59* 63* 65* 66 67* 68 69* 70; CN12 1* 2* 3* 5* 6* 7* 10* 12* 14* 15* 16* 18* 21* 22* 23* 24* 25* 26* 27* 28* 29* 30* 31* 33* 34* 36* 38* 41* 42* 46* 48* 50* 57* 58* 59* 60* 61* 62* 65* 66* 67* 68* 69* 70*

### Buses and harness runs
bus BUS[15..0] = port BUS[15..0]
bus BUS_C[7..0] = port BUS_C[7..0]

### Layout directives
net class Power: +5V, AVDD, GND

### Library data of the parts
Barcode_reader = CMP-1241-00374-1: 0.5 mm Pitch Easy-On(TM) Type FPC Connector, 2.0 mm Mated Height, Right Angle, ZIF, SMT, Bottom Contact, 12 Circuits, -20 to 85 degC, ELV and RoHS Compliant, Tape and Reel; Manufacturer: Molex; Pitch - Mating Interface: 0.50mm; PCB Retention: Yes; Current (Max per Contact): 0.5A; Material - Metal: Phosphor Bronze; Entry Angle: 90degrees Angle; Durability (mating cycles max): 20; Mated Height: 2.00mm; Circuits (Loaded): 12; Material - Plating Termination: Gold; Stackable: No; Voltage (Max): 50V; PackageReference: 52746-1271; Polarized to PCB: Yes; ComponentLink1Description: Manufacturer URL; ComponentLink1URL: http://www.molex.com/molex/index.jsp; ComponentLink2URL: http://www.molex.com/webdocs/datasheets/pdf/en-us/0527461271_FFC_FPC_CONNECTORS.pdf; Mounting Technology: Surface Mount; Orientation: Right Angle; Packing: Tape and Reel; ComponentLink3Description: Package Specification; ComponentLink3URL: http://www.molex.com/pdm_docs/sd/527461271_sd.pdf; Number of Rows: 1; Contact Position: Bottom; PackageVersion: Rev. H, 05/2009; RoHS: TRUE; Material - Plating Mating: Gold; PartNumber: 52746-1271; ComponentLink2Description: Datasheet; PCB Locator: No; PackageDescription: 12-Lead FPC Connector, Pitch 0.5 mm
CN11 CN12 = MCD-01210: Header, 35x2, 2,54mm, VR, TH, Height 5.84mm/2.54mm; Parameter 1: 929975E-01-36-ND; ComponentLink1Description: digikey; ComponentLink1URL: https://www.digikey.com/en/products/detail/929975-01-36-RK/929975E-01-36-ND/1094325?itemSeq=354777972
Eval_Provide_Power provide_Power_for_eval = Header 2: Header, 2-Pin; LatestRevisionDate: 17-Jul-2002; LatestRevisionNote: Re-released for DXP Platform.; Publisher: Altium Limited; ComponentLink1Description: digikey; ComponentLink1URL: https://www.digikey.com/en/products/detail/61300211121/732-5315-ND/4846823?itemSeq=354348989; digikey_part_NO: 732-5315-ND

## Sheet Channel.SchDoc
size A3
Used 24 times, as channels CH1, CH2, CH3, CH4, CH5, CH6, CH7, CH8, CH9, CH10, CH11, CH12, CH13, CH14, CH15, CH16, CH17, CH18, CH19, CH20, CH21, CH22, CH23, CH24. Parts and nets are listed once, with the designators drawn on the sheet.
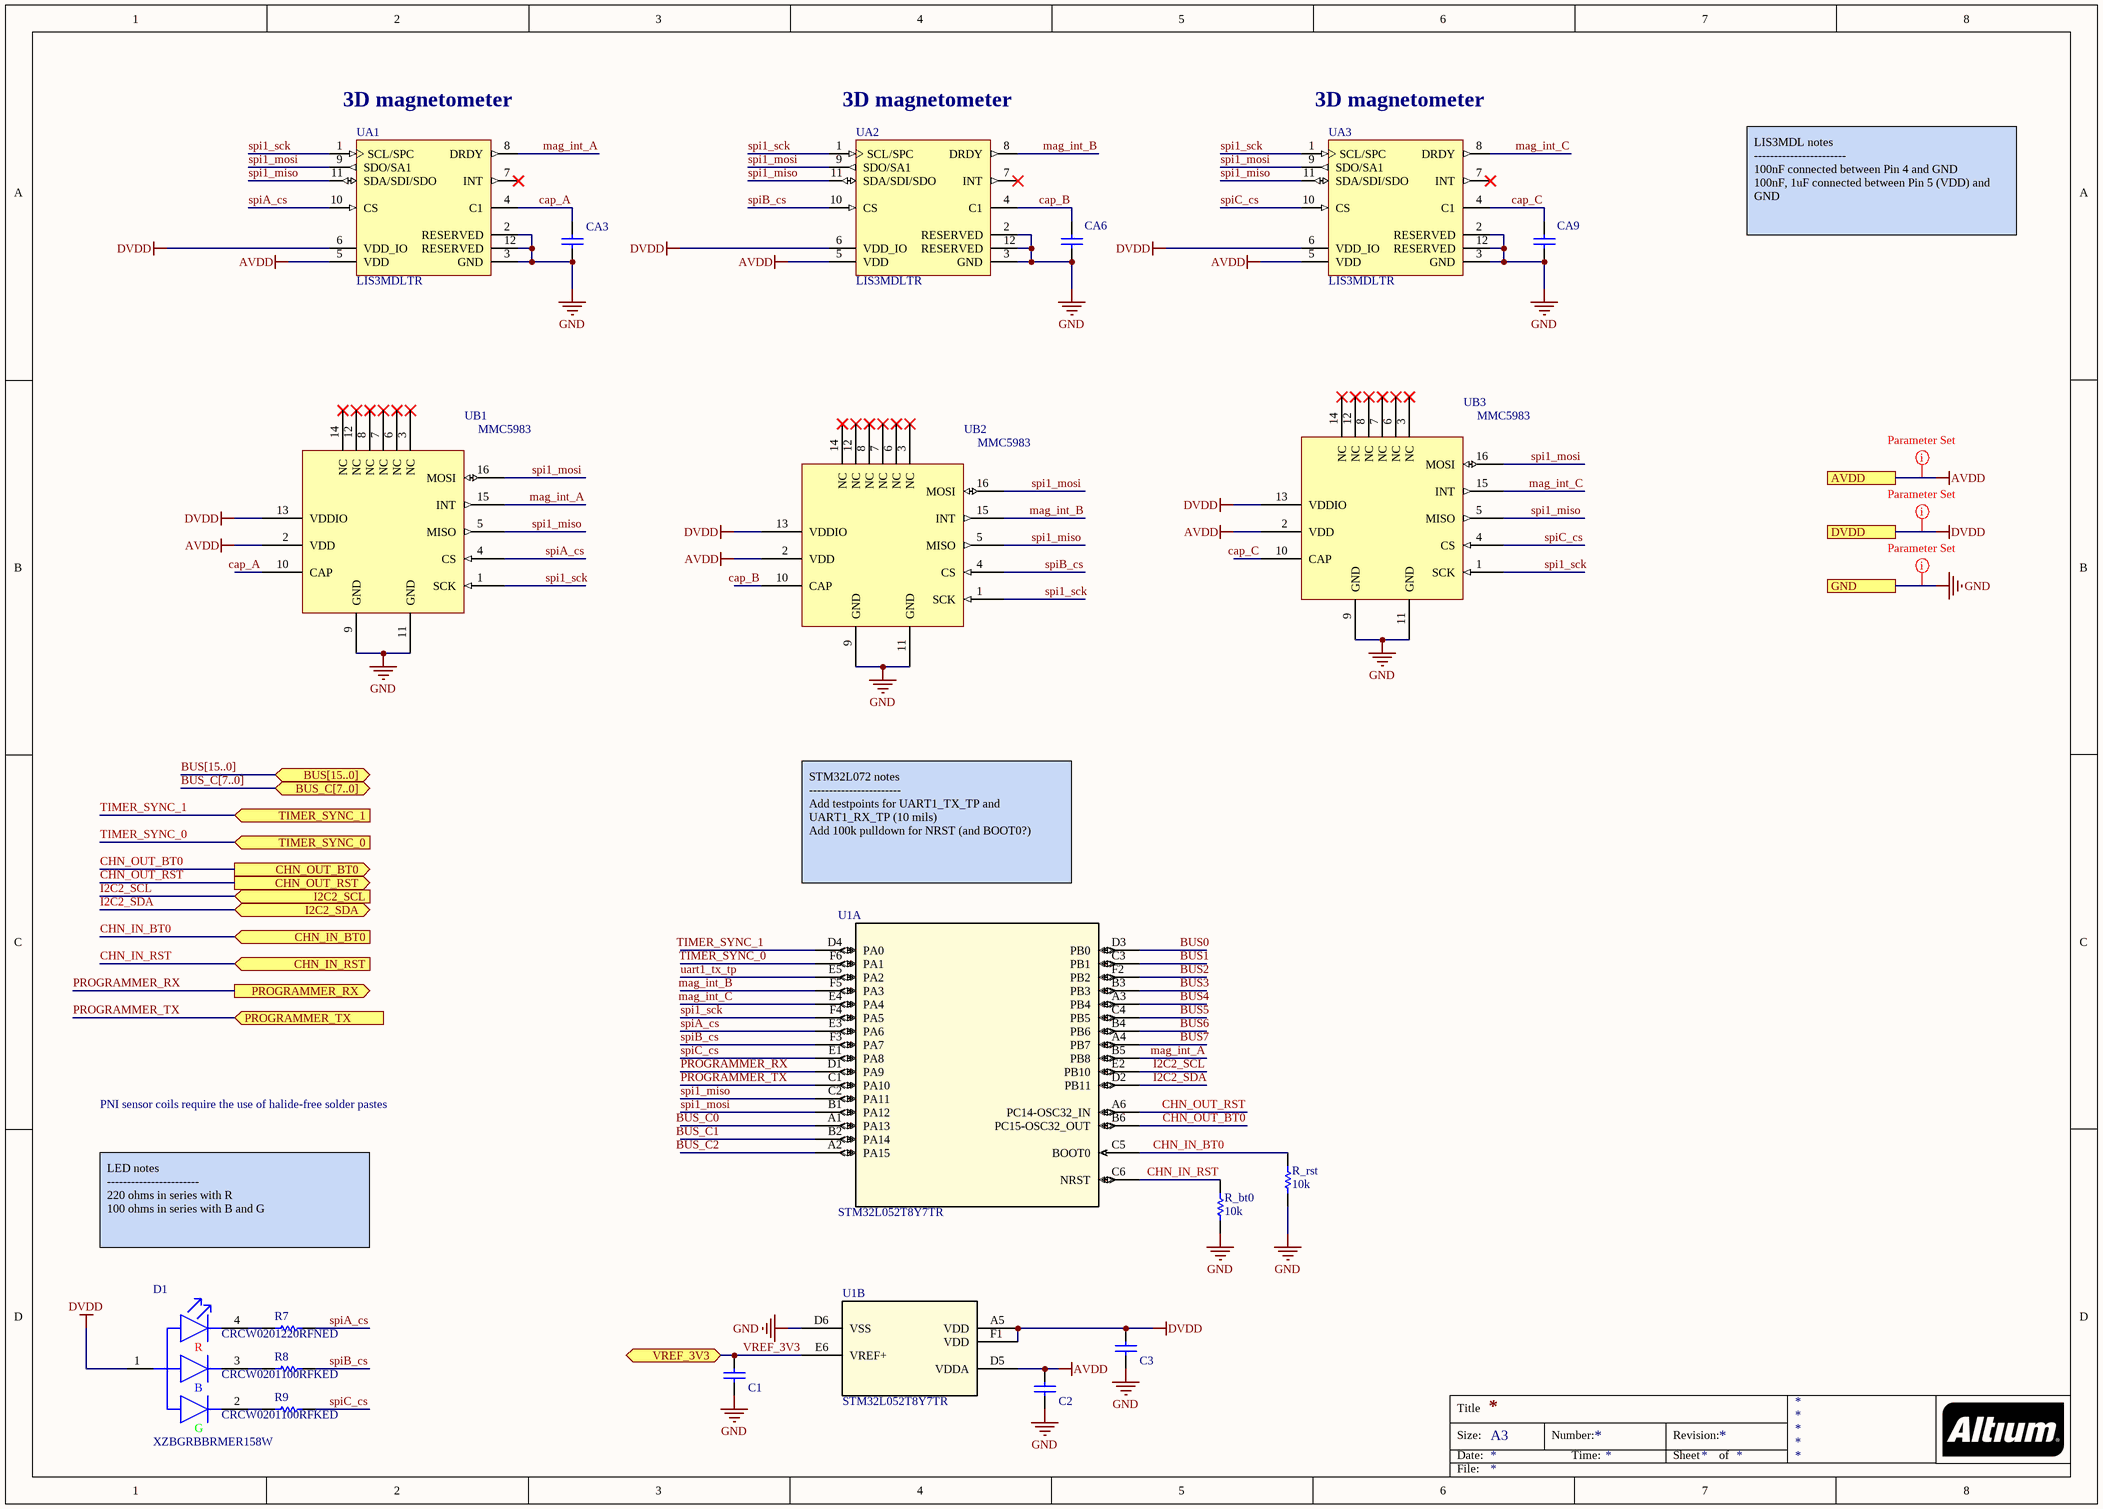
[diagram p6: Channel.SchDoc]

### Parts
C1  GRM155R71C104KA88D  [CAPC1005X55X25NL05T10]  (value not drawn)
C2  GRM155R71C104KA88D  [CAPC1005X55X25NL05T10]  (value not drawn)
C3  GRM155R71C104KA88D  [CAPC1005X55X25NL05T10]  (value not drawn)
CA3  GRM155R71C104KA88D  [CAPC1005X55X25NL05T10]  (value not drawn)
CA6  GRM155R71C104KA88D  [CAPC1005X55X25NL05T10]  (value not drawn)
CA9  GRM155R71C104KA88D  [CAPC1005X55X25NL05T10]  (value not drawn)
D1  XZBGRBBRMER158W  [4-SMD]
R7  CRCW0201220RFNED  [RESC0603X28X15LL05T05]
R8  CRCW0201100RFKED  [RESC0603X28X15LL05T05]
R9  CRCW0201100RFKED  [RESC0603X28X15LL05T05]
R_bt0  10k  [RESC0603X28X15LL05T05]
R_rst  10k  [RESC0603X28X15LL05T05]
U1  STM32L052T8Y7TR  [WLCSP36L_DIE417]  (parts A,B of 2)
UA1  LIS3MDLTR  [STM-LGA-12]
UA2  LIS3MDLTR  [STM-LGA-12]
UA3  LIS3MDLTR  [STM-LGA-12]
UB1  MMC5983  [LGA_16]
UB2  MMC5983  [LGA_16]
UB3  MMC5983  [LGA_16]

### Ports
AVDD, BUS[15..0] (bidir), BUS_C[7..0] (bidir), CHN_IN_BT0 (in), CHN_IN_RST (in), CHN_OUT_BT0 (out), CHN_OUT_RST (out), DVDD, GND, I2C2_SCL (in), I2C2_SDA (bidir), PROGRAMMER_RX (out), PROGRAMMER_TX (in), TIMER_SYNC_0 (in), TIMER_SYNC_1 (in), VREF_3V3 (bidir)

### Nets
AVDD: C2.2 U1.D5(VDDA) UA1.5(VDD) UA2.5(VDD) UA3.5(VDD) UB1.2(VDD) UB2.2(VDD) UB3.2(VDD) ; port AVDD
DVDD: C3.2 D1.1 U1.A5(VDD) U1.F1(VDD) UA1.6(VDD_IO) UA2.6(VDD_IO) UA3.6(VDD_IO) UB1.13(VDDIO) UB2.13(VDDIO) UB3.13(VDDIO) ; port DVDD
GND: C1.1 C2.1 C3.1 CA3.1 CA6.1 CA9.1 R_bt0.1 R_rst.1 U1.D6(VSS) UA1.2(RESERVED) UA1.3(GND) UA1.12(RESERVED) UA2.2(RESERVED) UA2.3(GND) UA2.12(RESERVED) UA3.2(RESERVED) UA3.3(GND) UA3.12(RESERVED) UB1.9(GND) UB1.11(GND) UB2.9(GND) UB2.11(GND) UB3.9(GND) UB3.11(GND) ; port GND
BUS0: U1.D3(PB0)
BUS1: U1.C3(PB1)
BUS2: U1.F2(PB2)
BUS3: U1.B3(PB3)
BUS4: U1.A3(PB4)
BUS5: U1.C4(PB5)
BUS6: U1.B4(PB6)
BUS7: U1.A4(PB7)
BUS_C0: U1.A1(PA13)
BUS_C1: U1.B2(PA14)
BUS_C2: U1.A2(PA15)
cap_A: CA3.2 UA1.4(C1) UB1.10(CAP)
cap_B: CA6.2 UA2.4(C1) UB2.10(CAP)
cap_C: CA9.2 UA3.4(C1) UB3.10(CAP)
CHN_IN_BT0: R_rst.2 U1.C5(BOOT0) ; port CHN_IN_BT0
CHN_IN_RST: R_bt0.2 U1.C6(NRST) ; port CHN_IN_RST
CHN_OUT_BT0: U1.B6(PC15-OSC32_OUT) ; port CHN_OUT_BT0
CHN_OUT_RST: U1.A6(PC14-OSC32_IN) ; port CHN_OUT_RST
I2C2_SCL: U1.E2(PB10) ; port I2C2_SCL
I2C2_SDA: U1.D2(PB11) ; port I2C2_SDA
mag_int_A: U1.B5(PB8) UA1.8(DRDY) UB1.15(INT)
mag_int_B: U1.F5(PA3) UA2.8(DRDY) UB2.15(INT)
mag_int_C: U1.E4(PA4) UA3.8(DRDY) UB3.15(INT)
PROGRAMMER_RX: U1.D1(PA9) ; port PROGRAMMER_RX
PROGRAMMER_TX: U1.C1(PA10) ; port PROGRAMMER_TX
spi1_miso: U1.C2(PA11) UA1.11(SDA/SDI/SDO) UA2.11(SDA/SDI/SDO) UA3.11(SDA/SDI/SDO) UB1.5(MISO) UB2.5(MISO) UB3.5(MISO)
spi1_mosi: U1.B1(PA12) UA1.9(SDO/SA1) UA2.9(SDO/SA1) UA3.9(SDO/SA1) UB1.16(MOSI) UB2.16(MOSI) UB3.16(MOSI)
spi1_sck: U1.F4(PA5) UA1.1(SCL/SPC) UA2.1(SCL/SPC) UA3.1(SCL/SPC) UB1.1(SCK) UB2.1(SCK) UB3.1(SCK)
spiA_cs: R7.2 U1.E3(PA6) UA1.10(CS) UB1.4(CS)
spiB_cs: R8.2 U1.F3(PA7) UA2.10(CS) UB2.4(CS)
spiC_cs: R9.2 U1.E1(PA8) UA3.10(CS) UB3.4(CS)
TIMER_SYNC_0: U1.F6(PA1) ; port TIMER_SYNC_0
TIMER_SYNC_1: U1.D4(PA0) ; port TIMER_SYNC_1
uart1_tx_tp: U1.E5(PA2)
VREF_3V3: C1.2 U1.E6(VREF+) ; port VREF_3V3
NetD1_2: D1.2 R9.1
NetD1_3: D1.3 R8.1
NetD1_4: D1.4 R7.1

Not connected (* = marked no-connect by the designer): UA1 7(INT)*; UA2 7(INT)*; UA3 7(INT)*; UB1 3(NC)* 6(NC)* 7(NC)* 8(NC)* 12(NC)* 14(NC)*; UB2 3(NC)* 6(NC)* 7(NC)* 8(NC)* 12(NC)* 14(NC)*; UB3 3(NC)* 6(NC)* 7(NC)* 8(NC)* 12(NC)* 14(NC)*

### Channels
CH1: designators end in _CH1; ports AVDD=AVDD CHN_IN_BT0=CHN_BT0_0 CHN_IN_RST=CHN_IN_RST CHN_OUT_BT0=CHN_BT0_1 CHN_OUT_RST=CHN_IN_RST DVDD=AVDD GND=GND I2C2_SCL=I2C2_SCL I2C2_SDA=I2C2_SDA PROGRAMMER_RX=PROGRAMMER_RX PROGRAMMER_TX=PROGRAMMER_TX TIMER_SYNC_0=TIMER_SYNC_0 TIMER_SYNC_1=TIMER_SYNC_1 VREF_3V3=AVDD
CH2: designators end in _CH2; ports AVDD=AVDD CHN_IN_BT0=CHN_BT0_1 CHN_IN_RST=CHN_IN_RST CHN_OUT_BT0=CHN_BT0_2 CHN_OUT_RST=CHN_IN_RST DVDD=AVDD GND=GND I2C2_SCL=I2C2_SCL I2C2_SDA=I2C2_SDA PROGRAMMER_RX=PROGRAMMER_RX PROGRAMMER_TX=PROGRAMMER_TX TIMER_SYNC_0=TIMER_SYNC_0 TIMER_SYNC_1=TIMER_SYNC_1 VREF_3V3=AVDD
CH3: designators end in _CH3; ports AVDD=AVDD CHN_IN_BT0=CHN_BT0_2 CHN_IN_RST=CHN_IN_RST CHN_OUT_BT0=CHN_BT0_3 CHN_OUT_RST=CHN_IN_RST DVDD=AVDD GND=GND I2C2_SCL=I2C2_SCL I2C2_SDA=I2C2_SDA PROGRAMMER_RX=PROGRAMMER_RX PROGRAMMER_TX=PROGRAMMER_TX TIMER_SYNC_0=TIMER_SYNC_0 TIMER_SYNC_1=TIMER_SYNC_1 VREF_3V3=AVDD
CH4: designators end in _CH4; ports AVDD=AVDD CHN_IN_BT0=CHN_BT0_3 CHN_IN_RST=CHN_IN_RST CHN_OUT_BT0=CHN_BT0_4 CHN_OUT_RST=CHN_IN_RST DVDD=AVDD GND=GND I2C2_SCL=I2C2_SCL I2C2_SDA=I2C2_SDA PROGRAMMER_RX=PROGRAMMER_RX PROGRAMMER_TX=PROGRAMMER_TX TIMER_SYNC_0=TIMER_SYNC_0 TIMER_SYNC_1=TIMER_SYNC_1 VREF_3V3=AVDD
CH5: designators end in _CH5; ports AVDD=AVDD CHN_IN_BT0=CHN_BT0_4 CHN_IN_RST=CHN_IN_RST CHN_OUT_BT0=CHN_BT0_5 CHN_OUT_RST=CHN_IN_RST DVDD=AVDD GND=GND I2C2_SCL=I2C2_SCL I2C2_SDA=I2C2_SDA PROGRAMMER_RX=PROGRAMMER_RX PROGRAMMER_TX=PROGRAMMER_TX TIMER_SYNC_0=TIMER_SYNC_0 TIMER_SYNC_1=TIMER_SYNC_1 VREF_3V3=AVDD
CH6: designators end in _CH6; ports AVDD=AVDD CHN_IN_BT0=CHN_BT0_5 CHN_IN_RST=CHN_IN_RST CHN_OUT_BT0=CHN_BT0_6 CHN_OUT_RST=CHN_IN_RST DVDD=AVDD GND=GND I2C2_SCL=I2C2_SCL I2C2_SDA=I2C2_SDA PROGRAMMER_RX=PROGRAMMER_RX PROGRAMMER_TX=PROGRAMMER_TX TIMER_SYNC_0=TIMER_SYNC_0 TIMER_SYNC_1=TIMER_SYNC_1 VREF_3V3=AVDD
CH7: designators end in _CH7; ports AVDD=AVDD CHN_IN_BT0=CHN_BT0_6 CHN_IN_RST=CHN_IN_RST CHN_OUT_BT0=CHN_BT0_7 CHN_OUT_RST=CHN_IN_RST DVDD=AVDD GND=GND I2C2_SCL=I2C2_SCL I2C2_SDA=I2C2_SDA PROGRAMMER_RX=PROGRAMMER_RX PROGRAMMER_TX=PROGRAMMER_TX TIMER_SYNC_0=TIMER_SYNC_0 TIMER_SYNC_1=TIMER_SYNC_1 VREF_3V3=AVDD
CH8: designators end in _CH8; ports AVDD=AVDD CHN_IN_BT0=CHN_BT0_7 CHN_IN_RST=CHN_IN_RST CHN_OUT_BT0=CHN_BT0_8 CHN_OUT_RST=CHN_IN_RST DVDD=AVDD GND=GND I2C2_SCL=I2C2_SCL I2C2_SDA=I2C2_SDA PROGRAMMER_RX=PROGRAMMER_RX PROGRAMMER_TX=PROGRAMMER_TX TIMER_SYNC_0=TIMER_SYNC_0 TIMER_SYNC_1=TIMER_SYNC_1 VREF_3V3=AVDD
CH9: designators end in _CH9; ports AVDD=AVDD CHN_IN_BT0=CHN_BT0_8 CHN_IN_RST=CHN_IN_RST CHN_OUT_BT0=CHN_BT0_9 CHN_OUT_RST=CHN_IN_RST DVDD=AVDD GND=GND I2C2_SCL=I2C2_SCL I2C2_SDA=I2C2_SDA PROGRAMMER_RX=PROGRAMMER_RX PROGRAMMER_TX=PROGRAMMER_TX TIMER_SYNC_0=TIMER_SYNC_0 TIMER_SYNC_1=TIMER_SYNC_1 VREF_3V3=AVDD
CH10: designators end in _CH10; ports AVDD=AVDD CHN_IN_BT0=CHN_BT0_9 CHN_IN_RST=CHN_IN_RST CHN_OUT_BT0=CHN_BT0_10 CHN_OUT_RST=CHN_IN_RST DVDD=AVDD GND=GND I2C2_SCL=I2C2_SCL I2C2_SDA=I2C2_SDA PROGRAMMER_RX=PROGRAMMER_RX PROGRAMMER_TX=PROGRAMMER_TX TIMER_SYNC_0=TIMER_SYNC_0 TIMER_SYNC_1=TIMER_SYNC_1 VREF_3V3=AVDD
CH11: designators end in _CH11; ports AVDD=AVDD CHN_IN_BT0=CHN_BT0_10 CHN_IN_RST=CHN_IN_RST CHN_OUT_BT0=CHN_BT0_11 CHN_OUT_RST=CHN_IN_RST DVDD=AVDD GND=GND I2C2_SCL=I2C2_SCL I2C2_SDA=I2C2_SDA PROGRAMMER_RX=PROGRAMMER_RX PROGRAMMER_TX=PROGRAMMER_TX TIMER_SYNC_0=TIMER_SYNC_0 TIMER_SYNC_1=TIMER_SYNC_1 VREF_3V3=AVDD
CH12: designators end in _CH12; ports AVDD=AVDD CHN_IN_BT0=CHN_BT0_11 CHN_IN_RST=CHN_IN_RST CHN_OUT_BT0=CHN_BT0_12 CHN_OUT_RST=CHN_IN_RST DVDD=AVDD GND=GND I2C2_SCL=I2C2_SCL I2C2_SDA=I2C2_SDA PROGRAMMER_RX=PROGRAMMER_RX PROGRAMMER_TX=PROGRAMMER_TX TIMER_SYNC_0=TIMER_SYNC_0 TIMER_SYNC_1=TIMER_SYNC_1 VREF_3V3=AVDD
CH13: designators end in _CH13; ports AVDD=AVDD CHN_IN_BT0=CHN_BT0_12 CHN_IN_RST=CHN_IN_RST CHN_OUT_BT0=CHN_BT0_13 CHN_OUT_RST=CHN_IN_RST DVDD=AVDD GND=GND I2C2_SCL=I2C2_SCL I2C2_SDA=I2C2_SDA PROGRAMMER_RX=PROGRAMMER_RX PROGRAMMER_TX=PROGRAMMER_TX TIMER_SYNC_0=TIMER_SYNC_0 TIMER_SYNC_1=TIMER_SYNC_1 VREF_3V3=AVDD
CH14: designators end in _CH14; ports AVDD=AVDD CHN_IN_BT0=CHN_BT0_13 CHN_IN_RST=CHN_IN_RST CHN_OUT_BT0=CHN_BT0_14 CHN_OUT_RST=CHN_IN_RST DVDD=AVDD GND=GND I2C2_SCL=I2C2_SCL I2C2_SDA=I2C2_SDA PROGRAMMER_RX=PROGRAMMER_RX PROGRAMMER_TX=PROGRAMMER_TX TIMER_SYNC_0=TIMER_SYNC_0 TIMER_SYNC_1=TIMER_SYNC_1 VREF_3V3=AVDD
CH15: designators end in _CH15; ports AVDD=AVDD CHN_IN_BT0=CHN_BT0_14 CHN_IN_RST=CHN_IN_RST CHN_OUT_BT0=CHN_BT0_15 CHN_OUT_RST=CHN_IN_RST DVDD=AVDD GND=GND I2C2_SCL=I2C2_SCL I2C2_SDA=I2C2_SDA PROGRAMMER_RX=PROGRAMMER_RX PROGRAMMER_TX=PROGRAMMER_TX TIMER_SYNC_0=TIMER_SYNC_0 TIMER_SYNC_1=TIMER_SYNC_1 VREF_3V3=AVDD
CH16: designators end in _CH16; ports AVDD=AVDD CHN_IN_BT0=CHN_BT0_15 CHN_IN_RST=CHN_IN_RST CHN_OUT_BT0=CHN_BT0_16 CHN_OUT_RST=CHN_IN_RST DVDD=AVDD GND=GND I2C2_SCL=I2C2_SCL I2C2_SDA=I2C2_SDA PROGRAMMER_RX=PROGRAMMER_RX PROGRAMMER_TX=PROGRAMMER_TX TIMER_SYNC_0=TIMER_SYNC_0 TIMER_SYNC_1=TIMER_SYNC_1 VREF_3V3=AVDD
CH17: designators end in _CH17; ports AVDD=AVDD CHN_IN_BT0=CHN_BT0_16 CHN_IN_RST=CHN_IN_RST CHN_OUT_BT0=CHN_BT0_17 CHN_OUT_RST=CHN_IN_RST DVDD=AVDD GND=GND I2C2_SCL=I2C2_SCL I2C2_SDA=I2C2_SDA PROGRAMMER_RX=PROGRAMMER_RX PROGRAMMER_TX=PROGRAMMER_TX TIMER_SYNC_0=TIMER_SYNC_0 TIMER_SYNC_1=TIMER_SYNC_1 VREF_3V3=AVDD
CH18: designators end in _CH18; ports AVDD=AVDD CHN_IN_BT0=CHN_BT0_17 CHN_IN_RST=CHN_IN_RST CHN_OUT_BT0=CHN_BT0_18 CHN_OUT_RST=CHN_IN_RST DVDD=AVDD GND=GND I2C2_SCL=I2C2_SCL I2C2_SDA=I2C2_SDA PROGRAMMER_RX=PROGRAMMER_RX PROGRAMMER_TX=PROGRAMMER_TX TIMER_SYNC_0=TIMER_SYNC_0 TIMER_SYNC_1=TIMER_SYNC_1 VREF_3V3=AVDD
CH19: designators end in _CH19; ports AVDD=AVDD CHN_IN_BT0=CHN_BT0_18 CHN_IN_RST=CHN_IN_RST CHN_OUT_BT0=CHN_BT0_19 CHN_OUT_RST=CHN_IN_RST DVDD=AVDD GND=GND I2C2_SCL=I2C2_SCL I2C2_SDA=I2C2_SDA PROGRAMMER_RX=PROGRAMMER_RX PROGRAMMER_TX=PROGRAMMER_TX TIMER_SYNC_0=TIMER_SYNC_0 TIMER_SYNC_1=TIMER_SYNC_1 VREF_3V3=AVDD
CH20: designators end in _CH20; ports AVDD=AVDD CHN_IN_BT0=CHN_BT0_19 CHN_IN_RST=CHN_IN_RST CHN_OUT_BT0=CHN_BT0_20 CHN_OUT_RST=CHN_IN_RST DVDD=AVDD GND=GND I2C2_SCL=I2C2_SCL I2C2_SDA=I2C2_SDA PROGRAMMER_RX=PROGRAMMER_RX PROGRAMMER_TX=PROGRAMMER_TX TIMER_SYNC_0=TIMER_SYNC_0 TIMER_SYNC_1=TIMER_SYNC_1 VREF_3V3=AVDD
CH21: designators end in _CH21; ports AVDD=AVDD CHN_IN_BT0=CHN_BT0_20 CHN_IN_RST=CHN_IN_RST CHN_OUT_BT0=CHN_BT0_21 CHN_OUT_RST=CHN_IN_RST DVDD=AVDD GND=GND I2C2_SCL=I2C2_SCL I2C2_SDA=I2C2_SDA PROGRAMMER_RX=PROGRAMMER_RX PROGRAMMER_TX=PROGRAMMER_TX TIMER_SYNC_0=TIMER_SYNC_0 TIMER_SYNC_1=TIMER_SYNC_1 VREF_3V3=AVDD
CH22: designators end in _CH22; ports AVDD=AVDD CHN_IN_BT0=CHN_BT0_21 CHN_IN_RST=CHN_IN_RST CHN_OUT_BT0=CHN_BT0_22 CHN_OUT_RST=CHN_IN_RST DVDD=AVDD GND=GND I2C2_SCL=I2C2_SCL I2C2_SDA=I2C2_SDA PROGRAMMER_RX=PROGRAMMER_RX PROGRAMMER_TX=PROGRAMMER_TX TIMER_SYNC_0=TIMER_SYNC_0 TIMER_SYNC_1=TIMER_SYNC_1 VREF_3V3=AVDD
CH23: designators end in _CH23; ports AVDD=AVDD CHN_IN_BT0=CHN_BT0_22 CHN_IN_RST=CHN_IN_RST CHN_OUT_BT0=CHN_BT0_23 CHN_OUT_RST=CHN_IN_RST DVDD=AVDD GND=GND I2C2_SCL=I2C2_SCL I2C2_SDA=I2C2_SDA PROGRAMMER_RX=PROGRAMMER_RX PROGRAMMER_TX=PROGRAMMER_TX TIMER_SYNC_0=TIMER_SYNC_0 TIMER_SYNC_1=TIMER_SYNC_1 VREF_3V3=AVDD
CH24: designators end in _CH24; ports AVDD=AVDD CHN_IN_BT0=CHN_BT0_23 CHN_IN_RST=CHN_IN_RST CHN_OUT_BT0=CHN_OUT_BT0_CH24 CHN_OUT_RST=CHN_OUT_RST_CH24 DVDD=AVDD GND=GND I2C2_SCL=I2C2_SCL I2C2_SDA=I2C2_SDA PROGRAMMER_RX=PROGRAMMER_RX PROGRAMMER_TX=PROGRAMMER_TX TIMER_SYNC_0=TIMER_SYNC_0 TIMER_SYNC_1=TIMER_SYNC_1 VREF_3V3=AVDD

### Buses and harness runs
bus BUS[15..0] = port BUS[15..0]
bus BUS_C[7..0] = port BUS_C[7..0]

### Layout directives
net class Power: AVDD, GND

### Notes on the sheet
- (near UA1) 3D magnetometer
- (near UA2) 3D magnetometer
- (near UA3) 3D magnetometer
- LIS3MDL notes
  -----------------------
  100nF connected between Pin 4 and GND
  100nF, 1uF connected between Pin 5 (VDD) and GND
- STM32L072 notes
  -----------------------
  Add testpoints for UART1_TX_TP and UART1_RX_TP (10 mils)
  Add 100k pulldown for NRST (and BOOT0?)
- PNI sensor coils require the use of halide-free solder pastes
- LED notes
  -----------------------
  220 ohms in series with R
  100 ohms in series with B and G
- Title
- Size:
- Date:
- A3
- Number:
- Time:
- Revision:
- Sheet
- of
- File:
- (in symbol XZBGRBBRMER158W) R; B; G

### Library data of the parts
C1-C3 = CMP-2100-03641-1: Chip Capacitor, 10 uF, +/- 10%, 6 V, -55 to 125 degC, 0402 (1005 Metric), RoHS, Tape and Reel; Manufacturer: Murata; Material: Ceramic; Insulation Resistance: 10GR; Voltage: 16V; Dielectric: X7R; Capacitance: 100nF; REACH SVHC: NoSVHC; Depth: 0.5mm; Case/Package: 0402; Datasheet URL: http://psearch.en.murata.com/capacitor/product/GRM155R71C104KA88%23.pdf; Lead Free: LeadFree; Dielectric Material: Ceramic; Manufacturer URL: http://www.murata.com/; Min Operating Temperature: -55degC; Length: 1mm; Case Code (Metric): 1005; Radiation Hardening: No; Package Reference: 0402; RoHSCompliant: true; Datasheet Version: 42675.0; Thickness: 0.022inch; Packaging: TapeandReel; Voltage Rating (DC): 16V; Tolerance: 10%; Max Operating Temperature: 125degC; Package Description: 2-Pin Surface Mount Device, Body 1 x 0.5 mm; Mount: SurfaceMount; Height: 0.5mm; Width: 0.5mm; Number of Pins: 2; Voltage Rating: 16V; Case Code (Imperial): 0402; Termination: SMD/SMT; Package Quantity: 1
CA3 CA6 CA9 = CMP-2100-03641-1: Chip Capacitor, 0.1 uF, +/- 10%, 16 V, -55 to 125 degC, 0402 (1005 Metric), RoHS, Tape and Reel; Manufacturer: Murata; Dielectric Material: Ceramic; Insulation Resistance: 10GR; Voltage: 16V; Dielectric: X7R; Capacitance: 100nF; REACH SVHC: NoSVHC; Depth: 0.5mm; Case/Package: 0402; Datasheet URL: http://psearch.en.murata.com/capacitor/product/GRM155R71C104KA88%23.pdf; Lead Free: LeadFree; Material: Ceramic; Manufacturer URL: http://www.murata.com/; Min Operating Temperature: -55degC; Length: 1mm; Case Code (Metric): 1005; Radiation Hardening: No; Package Reference: 0402; RoHSCompliant: true; Datasheet Version: 42675.0; Thickness: 0.022inch; Packaging: TapeandReel; Voltage Rating (DC): 16V; Tolerance: 10%; Max Operating Temperature: 125degC; Package Description: 2-Pin Surface Mount Device, Body 1 x 0.5 mm; Mount: SurfaceMount; Height: 0.5mm; Width: 0.5mm; Number of Pins: 2; Voltage Rating: 16V; Case Code (Imperial): 0402; Termination: SMD/SMT; Package Quantity: 1
D1 = XZBGRBBRMER158W: 0.65x0.65x0.20mm (0202) Full-Color Surface Mount LED; digikey: https://www.digikey.com/en/products/detail/sunled/XZBGRBBRMER158W/8259030?s=N4IgTCBcDaIBoC0BCBxASkpaCyBRNAjAKwAcA6iALoC%2BQA
R7 = CMP-2004-00311-1: Manufacturer: Vishay Dale; Part Number: CRCW0201220RFNED; digikey: https://www.digikey.com/en/products/detail/vishay-dale/CRCW0201220RFNED/1199732?s=N4IgTCBcDaIMICU4HUAMZUEYwYQMQDkBRAERAF0BfIA
R8 R9 = CMP-2004-00005-1: Manufacturer: Vishay; Part Number: CRCW0201100RFKED; digikey: https://www.digikey.com/en/products/detail/vishay-dale/CRCW0201100RFKED/1967973?s=N4IgTCBcDaIMICU4HUAMZUEZOtQgYgNICiAIiALoC%2BQA
R_bt0 R_rst = CMP-2004-00311-1: Part Number: RC0201FR-0710KL; Manufacturer: Vishay Dale; digikey: https://www.digikey.com/en/products/detail/yageo/RC0201FR-0710KL/1948870?s=N4IgTCBcDaIEoGEAMYkEYBicC0SDsaSA0gDIgC6AvkA
U1 = STM32L052T8Y7TR: No Description Available; Vendor: STMicroelectronics; Built_By: EMA_UL_Team; SourceLibrary: STMicroelectronics_2020-10-07; Manufacturer_Part_Number: STM32L052T8Y7TR; Copyright: Copyright (C) 2018 Accelerated Designs. All rights reserved; RefDes: RefDes; Type: DEV; digikey: https://www.digikey.com/en/products/detail/stmicroelectronics/STM32L052T8Y7TR/7313146?s=N4IgTCBcDaIMoBUCyBmMAZADAVjAgHAJoDsCASiALoC%2BQA
UA1-UA3 = CMP-2000-07463-1: Digital Output Magnetic Sensor: Ultra-Low-Power, High-Performance 3-Axis Magnetometer, 1.9 to 3.6 V, -40 to 85 degC, 12-Pin LGA, RoHS, Tape and Reel; Manufacturer: STMicroelectronics; Max Supply Current: 270uA; Case\/Package: Module; Min Supply Voltage: 1.9V; Max Supply Voltage: 3.6V; Resolution: 16b; RoHSCompliant: true; Datasheet Version: Rev. 6, 05/2017; REACH SVHC: NoSVHC; Lead Free: LeadFree; Package Quantity: 8000; Package Description: 12-Pin Land Grid Array Package, Body 2 x 2 mm, Pitch 0.5 mm; Package Reference: LGA-12; Packaging: TapeandReel; Min Operating Temperature: -40degC; Mount: SurfaceMount; Contact Plating: Gold; Datasheet URL: http://www.st.com/content/ccc/resource/technical/document/datasheet/54/2a/85/76/e3/97/42/18/DM00075867.pdf/files/DM00075867.pdf/jcr:content/translations/en.DM00075867.pdf; Mounting Technology: SurfaceMount; Radiation Hardening: No; Number of Pins: 12; Max Operating Temperature: 85degC; Manufacturer URL: http://www.st.com/
  UA2: digikey: https://www.digikey.com/en/products/detail/stmicroelectronics/LIS3MDLTR/4309733?s=N4IgTCBcDaIDYEsDOBmAtgEziAugXyA
UB1-UB3 = U: MMC5983MA 3-axis magnetic sensor
  UB2: digikey: https://www.digikey.com/en/products/detail/memsic-inc/MMC5983MA/10452795?s=N4IgTCBcDaILJwMIFYCcAOAzCAugXyA